# EAGLE board TR4 (EAGLE 9.6.2), part 1 of 2
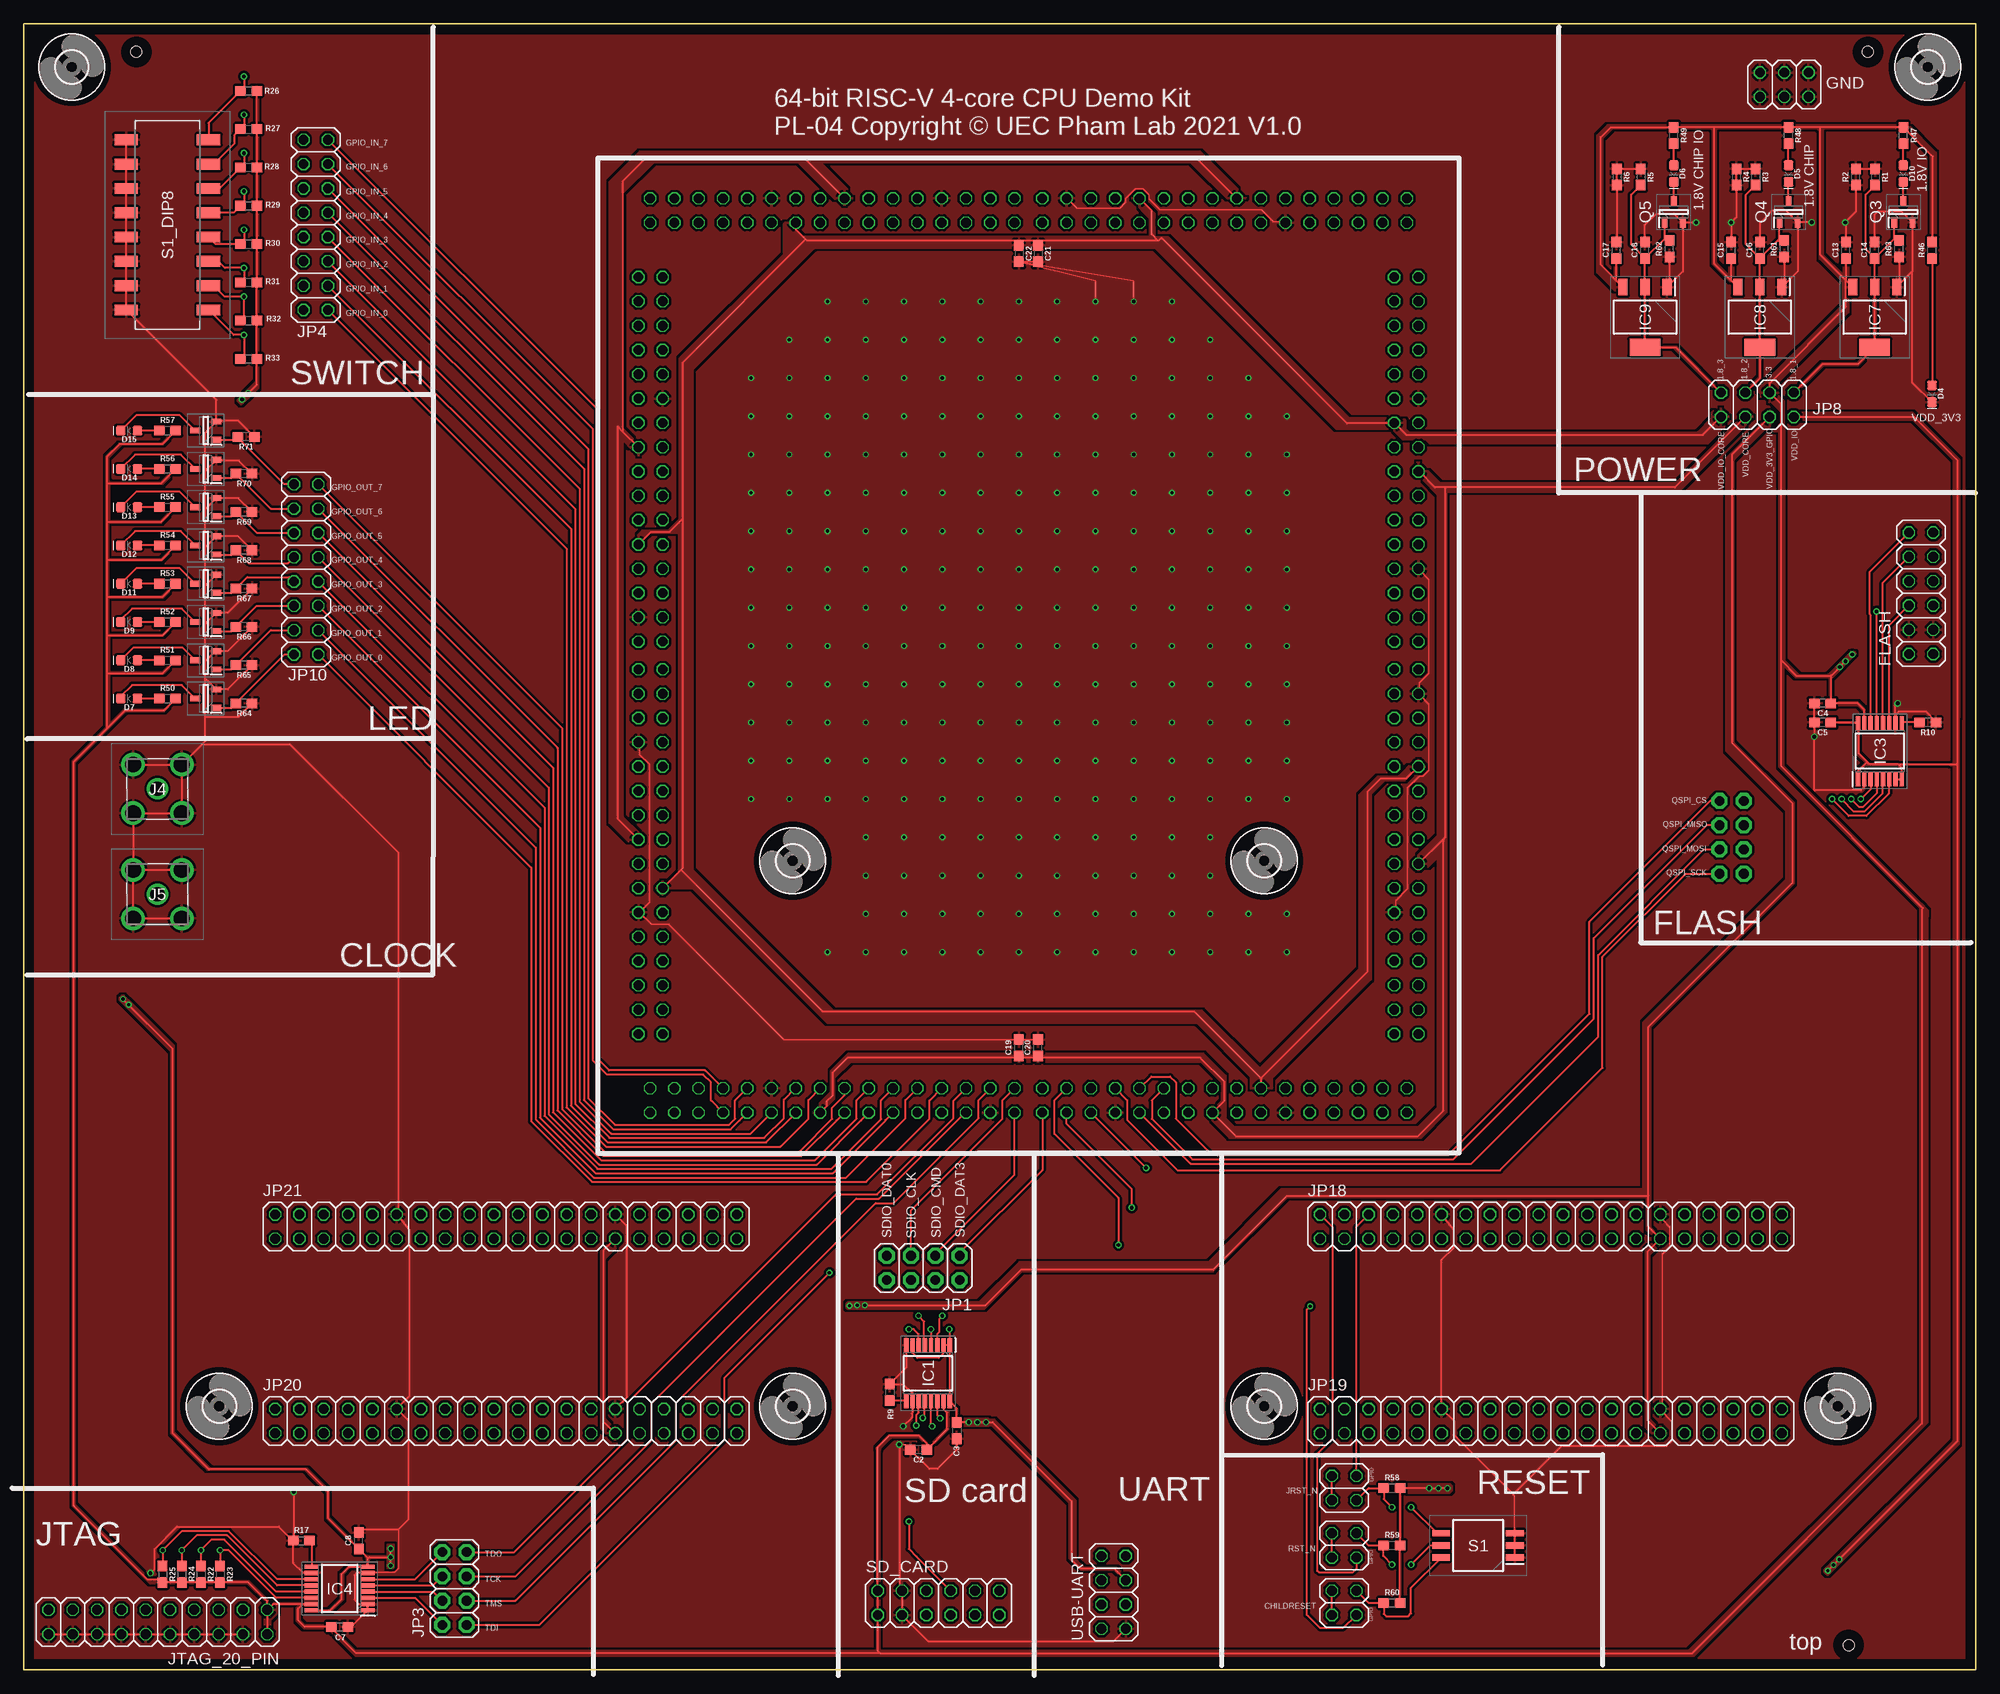
[diagram p5: board, top side]
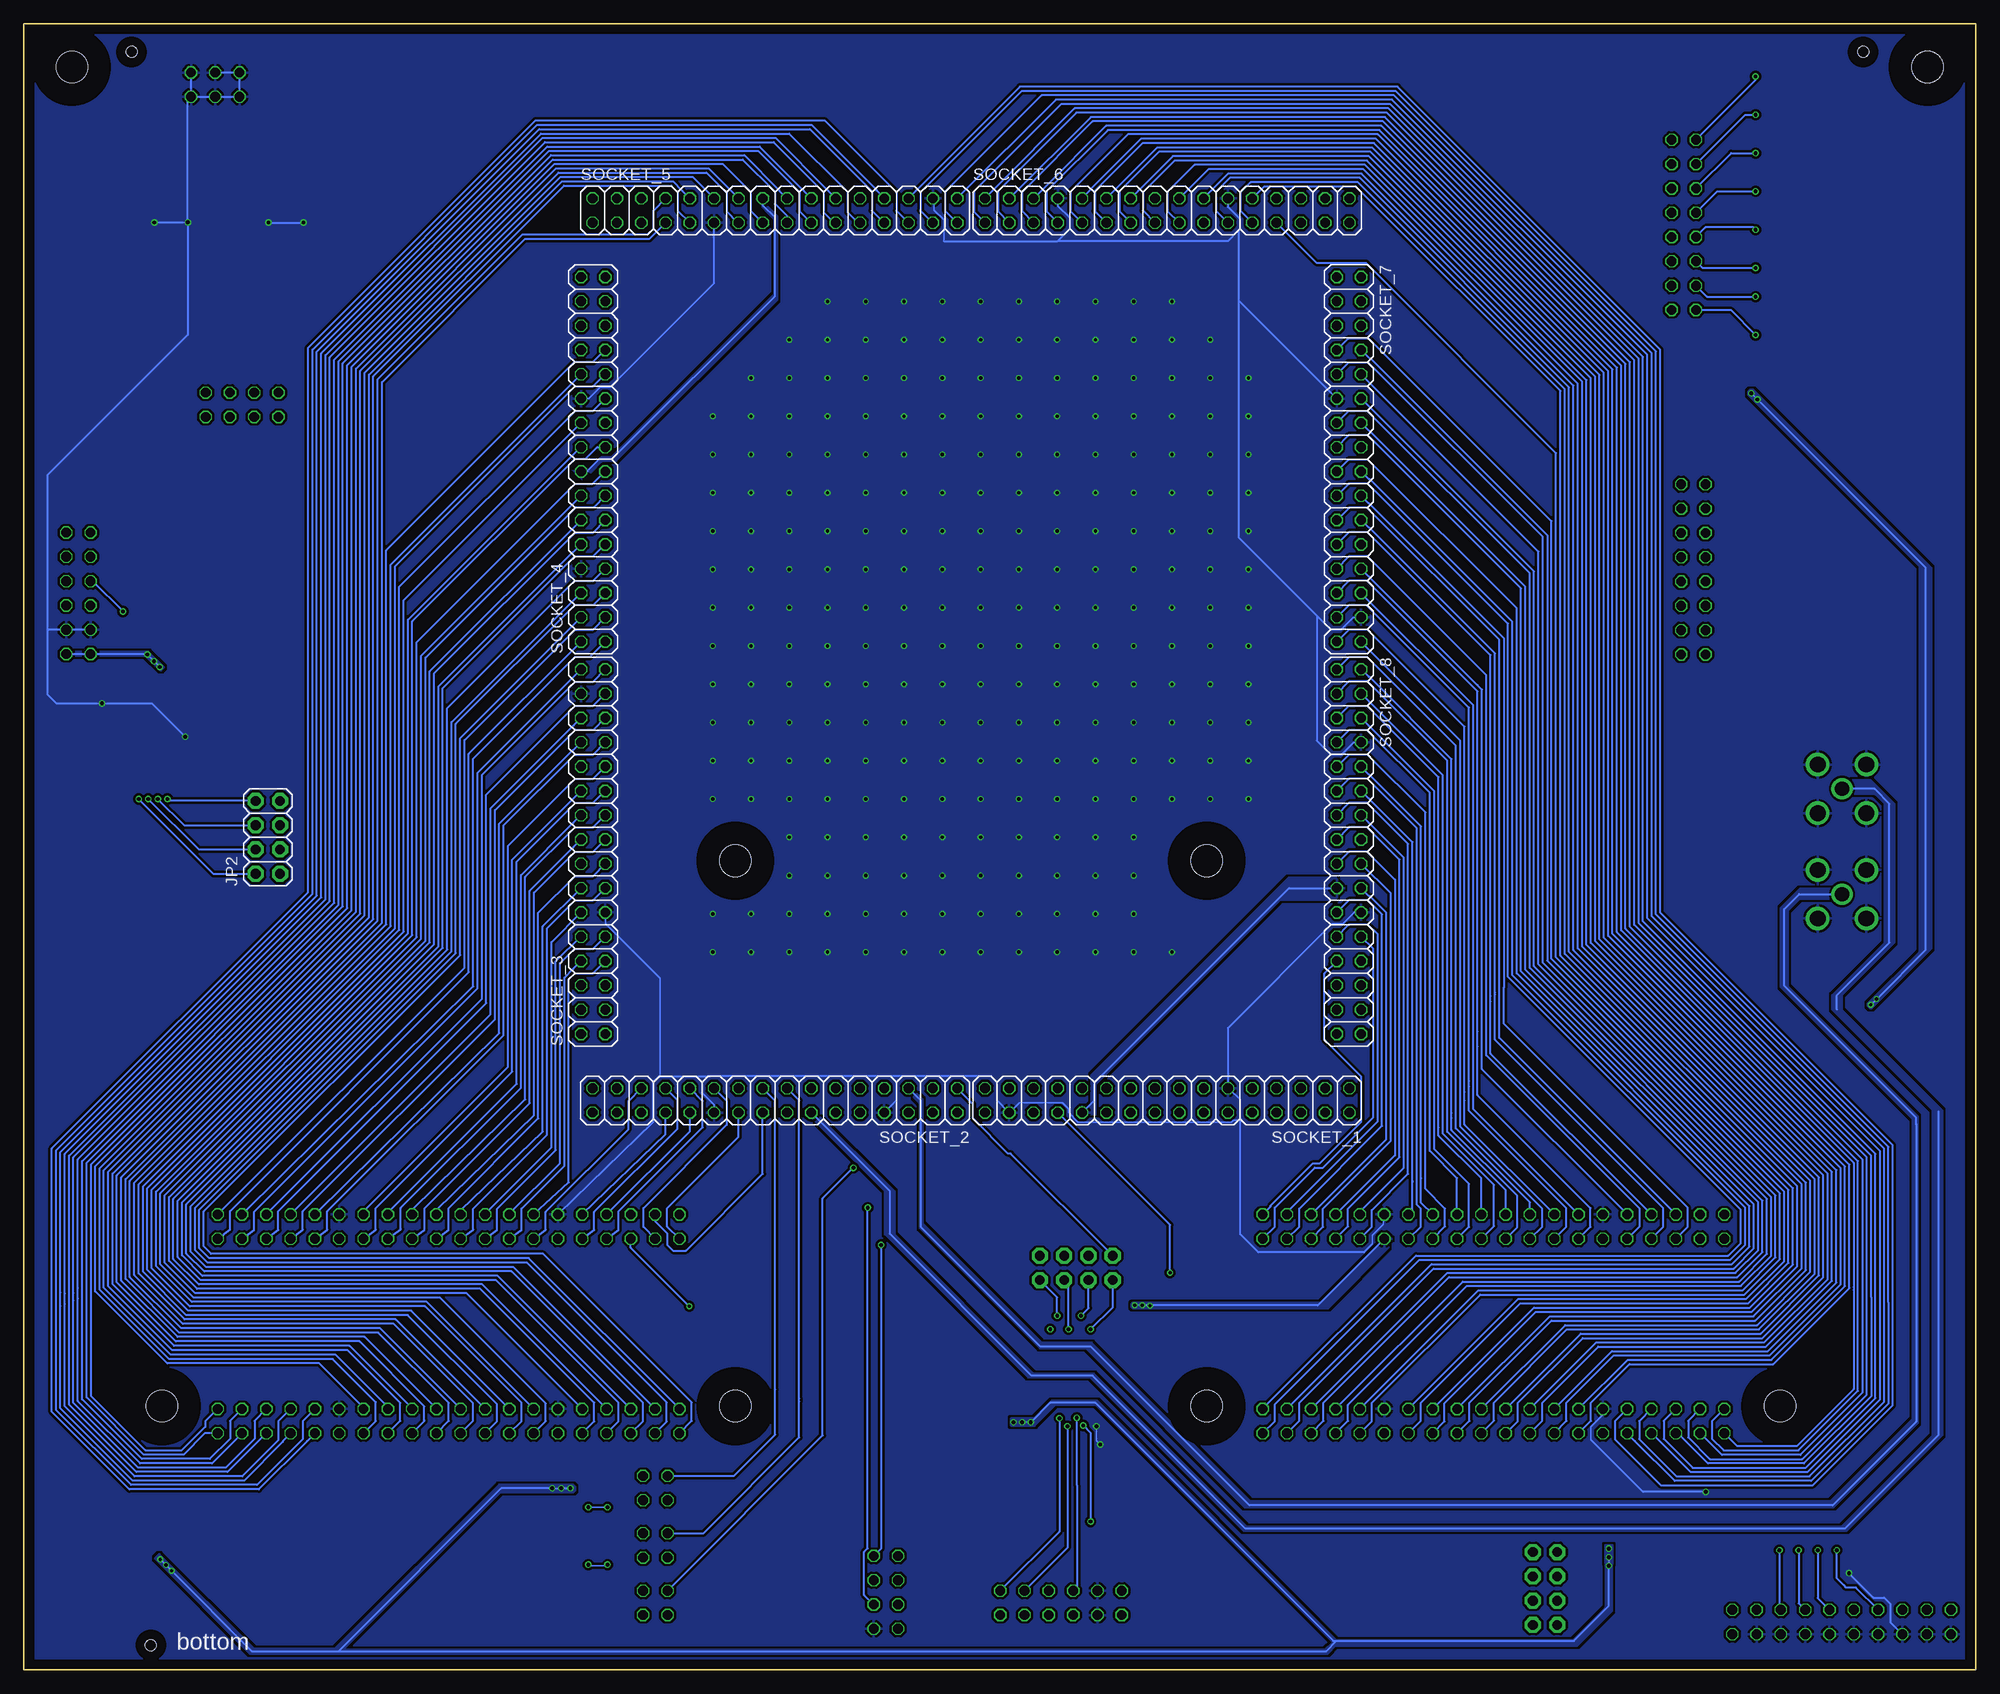
[diagram p6: board, bottom side, seen from below]

Size 204 x 172 mm. Coordinates in mm from the lower left corner, seen from the top.
Outline: 0,172 204,172 204,0 0,0 0,172
Copper layers (1*16): Top 0.035mm / dielectric 1.5mm / Bottom 0.035mm
Design rules "default *": minimum track width 6mil, minimum drill 0.35mm, track to track 10mil, track to pad 10mil, pad to pad 5mil, via to via 10mil, smd to smd 10mil, copper to edge 40mil, drill to drill 6mil, minimum pad ring 0.13mm, minimum via ring 0.13mm, stop-mask expansion 4mil, vias tented up to drill 0mil, thermal gap 10mil
Holes 1.15 mm at 190.74,2.59 192.74,169.09 11.74,169.09

## Footprints (pad centres in the part's own frame; a part is rotated, then mirrored left to right if it is on the bottom)
0603 = smd 1.1 x 1: 1 -0.85,0; 2 0.85,0
LED-0603 = smd 1 x 1: A -0.877,0; C 0.877,0
2X06 = drill 1.016 octagon: 1 -6.35,-1.27; 2 -6.35,1.27; 3 -3.81,-1.27; 4 -3.81,1.27; 5 -1.27,-1.27; 6 -1.27,1.27; 7 1.27,-1.27; 8 1.27,1.27; 9 3.81,-1.27; 10 3.81,1.27; 11 6.35,-1.27; 12 6.35,1.27
2X03 = drill 1.016 octagon: 1 -2.54,-1.27; 2 -2.54,1.27; 3 0,-1.27; 4 0,1.27; 5 2.54,-1.27; 6 2.54,1.27
3,3 = hole 3.3: 0,0
SOP65P640X120-16N = smd 1.475 x 0.45: 1 -2.938,2.275; 2 -2.938,1.625; 3 -2.938,0.975; 4 -2.938,0.325; 5 -2.938,-0.325; 6 -2.938,-0.975; 7 -2.938,-1.625; 8 -2.938,-2.275; 9 2.938,-2.275; 10 2.938,-1.625; 11 2.938,-0.975; 12 2.938,-0.325; 13 2.938,0.325; 14 2.938,0.975; 15 2.938,1.625; 16 2.938,2.275
SOT230P700X180-4N = smd 1.75 x 0.95: 1 -3.15,2.3; 2 -3.15,0; 3 -3.15,-2.3 | smd 1.75 x 3.2: 4 3.15,0
29856004 = drill 1.64 pad 2.46: 1 0,0; 2 5.08,0; 3 5.08,5.08; 4 0,5.08 | drill 1.47 pad 2.205: 5 2.54,2.54
2X04 = drill 1.016 pad 1.676 octagon: 1 -3.81,-1.27; 2 -3.81,1.27; 3 -1.27,-1.27; 4 -1.27,1.27; 5 1.27,-1.27; 6 1.27,1.27; 7 3.81,-1.27; 8 3.81,1.27
2X08 = drill 1.016 octagon: 1 -8.89,-1.27; 2 -8.89,1.27; 3 -6.35,-1.27; 4 -6.35,1.27; 5 -3.81,-1.27; 6 -3.81,1.27; 7 -1.27,-1.27; 8 -1.27,1.27; 9 1.27,-1.27; 10 1.27,1.27; 11 3.81,-1.27; 12 3.81,1.27; 13 6.35,-1.27; 14 6.35,1.27; 15 8.89,-1.27; 16 8.89,1.27
2X02 = drill 1.016 octagon: 1 -1.27,-1.27; 2 -1.27,1.27; 3 1.27,-1.27; 4 1.27,1.27
2X04' = drill 1.016 octagon: 1 -3.81,-1.27; 2 -3.81,1.27; 3 -1.27,-1.27; 4 -1.27,1.27; 5 1.27,-1.27; 6 1.27,1.27; 7 3.81,-1.27; 8 3.81,1.27
2X20 = drill 1.016 octagon: 1 -24.13,-1.27; 2 -24.13,1.27; 3 -21.59,-1.27; 4 -21.59,1.27; 5 -19.05,-1.27; 6 -19.05,1.27; 7 -16.51,-1.27; 8 -16.51,1.27; 9 -13.97,-1.27; 10 -13.97,1.27; 11 -11.43,-1.27; 12 -11.43,1.27; 13 -8.89,-1.27; 14 -8.89,1.27; 15 -6.35,-1.27; 16 -6.35,1.27; 17 -3.81,-1.27; 18 -3.81,1.27; 19 -1.27,-1.27; 20 -1.27,1.27; 21 1.27,-1.27; 22 1.27,1.27; 23 3.81,-1.27; 24 3.81,1.27; 25 6.35,-1.27; 26 6.35,1.27; 27 8.89,-1.27; 28 8.89,1.27; 29 11.43,-1.27; 30 11.43,1.27; 31 13.97,-1.27; 32 13.97,1.27; 33 16.51,-1.27; 34 16.51,1.27; 35 19.05,-1.27; 36 19.05,1.27; 37 21.59,-1.27; 38 21.59,1.27; 39 24.13,-1.27; 40 24.13,1.27
2X10 = drill 1.016 octagon: 1 -11.43,-1.27; 2 -11.43,1.27; 3 -8.89,-1.27; 4 -8.89,1.27; 5 -6.35,-1.27; 6 -6.35,1.27; 7 -3.81,-1.27; 8 -3.81,1.27; 9 -1.27,-1.27; 10 -1.27,1.27; 11 1.27,-1.27; 12 1.27,1.27; 13 3.81,-1.27; 14 3.81,1.27; 15 6.35,-1.27; 16 6.35,1.27; 17 8.89,-1.27; 18 8.89,1.27; 19 11.43,-1.27; 20 11.43,1.27
SOT95P230X110-3N = smd 1.05 x 0.6: 1 -1.1,0.95; 2 -1.1,-0.95; 3 1.1,0
SOT127P835X260-6N = smd 1.85 x 0.65: 1 -3.85,1.27; 2 -3.85,0; 3 -3.85,-1.27; 4 3.85,-1.27; 5 3.85,0; 6 3.85,1.27
2198LPST = smd 1.13 x 2.44: 1 -8.89,-4.3; 2 -6.35,-4.3; 3 -3.81,-4.3; 4 -1.27,-4.3; 5 1.27,-4.3; 6 3.81,-4.3; 7 6.35,-4.3; 8 8.89,-4.3; 9 8.89,4.3; 10 6.35,4.3; 11 3.81,4.3; 12 1.27,4.3; 13 -1.27,4.3; 14 -3.81,4.3; 15 -6.35,4.3; 16 -8.89,4.3
2X16 = drill 1.016 octagon: 1 -19.05,-1.27; 2 -19.05,1.27; 3 -16.51,-1.27; 4 -16.51,1.27; 5 -13.97,-1.27; 6 -13.97,1.27; 7 -11.43,-1.27; 8 -11.43,1.27; 9 -8.89,-1.27; 10 -8.89,1.27; 11 -6.35,-1.27; 12 -6.35,1.27; 13 -3.81,-1.27; 14 -3.81,1.27; 15 -1.27,-1.27; 16 -1.27,1.27; 17 1.27,-1.27; 18 1.27,1.27; 19 3.81,-1.27; 20 3.81,1.27; 21 6.35,-1.27; 22 6.35,1.27; 23 8.89,-1.27; 24 8.89,1.27; 25 11.43,-1.27; 26 11.43,1.27; 27 13.97,-1.27; 28 13.97,1.27; 29 16.51,-1.27; 30 16.51,1.27; 31 19.05,-1.27; 32 19.05,1.27

## Placement (x,y rotation side)
C2  0.1uF  [0603]  93.5,23 180 top
C3  0.1uF  [0603]  97.5,25 270 top
C4  0.1uF  [0603]  188,101 180 top
C5  0.1uF  [0603]  188,99 180 top
C7  0.1uF  [0603]  33,4.5 0 top
C8  0.1uF  [0603]  35,13.5 90 top
C13  10uF  [0603]  190.45,148.35 90 top
C14  100uF  [0603]  193.45,148.35 90 top
C15  10uF  [0603]  178.45,148.35 90 top
C16  100uF  [0603]  181.45,148.35 90 top
C17  10uF  [0603]  166.45,148.35 90 top
C18  100uF  [0603]  169.45,148.35 90 top
C19  0.1uF  [0603]  104,65 90 top
C20  10uF  [0603]  106,65 90 top
C21  0.1uF  [0603]  106,148 270 top
C22  10uF  [0603]  104,148 270 top
D4  [LED-0603]  199.45,133.35 270 top
D5  LED0  [LED-0603]  184.45,156.35 270 top
D6  LED0  [LED-0603]  172.45,156.35 270 top
D7  LED0  [LED-0603]  11,101.5 180 top
D8  LED0  [LED-0603]  11,105.5 180 top
D9  LED0  [LED-0603]  11,109.5 180 top
D10  LED0  [LED-0603]  196.45,156.35 270 top
D11  LED0  [LED-0603]  11,113.5 180 top
D12  LED0  [LED-0603]  11,117.5 180 top
D13  LED0  [LED-0603]  11,121.5 180 top
D14  LED0  [LED-0603]  11,125.5 180 top
D15  LED0  [LED-0603]  11,129.5 180 top
FLASH  PINHD-2X6  [2X06]  198.3,112.5 90 top
GND  PINHD-2X3  [2X03]  184,165.65 0 top
H1  MOUNT-HOLE3.3  [3,3]  20.42,27.55 0 top
H2  MOUNT-HOLE3.3  [3,3]  189.58,27.55 0 top
H3  MOUNT-HOLE3.3  [3,3]  5,167.5 0 top
H4  MOUNT-HOLE3.3  [3,3]  199,167.5 0 top
H5  MOUNT-HOLE3.3  [3,3]  80.36,27.55 0 top
H6  MOUNT-HOLE3.3  [3,3]  129.64,27.55 0 top
H7  MOUNT-HOLE3.3  [3,3]  129.64,84.55 0 top
H8  MOUNT-HOLE3.3  [3,3]  80.36,84.55 0 top
IC1  SN74AVC4T774PWR  [SOP65P640X120-16N]  94.5,31 270 top
IC3  SN74AVC4T774PWR  [SOP65P640X120-16N]  194,96 90 top
IC4  SN74AVC4T774PWR  [SOP65P640X120-16N]  33,8.5 180 top
IC7  LM1117IMPX-ADJ/NOPB  [SOT230P700X180-4N]  193.45,141.35 270 top
IC8  LM1117IMPX-ADJ/NOPB  [SOT230P700X180-4N]  181.45,141.35 270 top
IC9  LM1117IMPX-ADJ/NOPB  [SOT230P700X180-4N]  169.45,141.35 270 top
J4  2985-6004  [29856004]  16.5,94.6 180 top
J5  2985-6004  [29856004]  16.5,83.6 180 top
JP1  [2X04]  94,42 180 top
JP2  [2X04]  178.5,87 90 bottom
JP3  [2X04]  45,8.5 90 top
JP4  [2X08]  30.5,151 90 top
JP5  [2X02]  138,13 90 top
JP6  [2X02]  138,19 90 top
JP8  PINHD-2X4  [2X04']  181.2,132.2 180 top
JP10  [2X08]  29.5,115 90 top
JP18  [2X20]  159.61,46.32 0 top
JP19  [2X20]  159.61,26 0 top
JP20  [2X20]  50.39,26 0 top
JP21  [2X20]  50.39,46.32 0 top
JP24  [2X02]  138,7 90 top
JTAG_20_PIN  [2X10]  14,5 180 top
Q3  BSH103,235  [SOT95P230X110-3N]  196.45,152.35 90 top
Q4  BSH103,235  [SOT95P230X110-3N]  184.45,152.35 90 top
Q5  BSH103,235  [SOT95P230X110-3N]  172.45,152.35 90 top
Q6  BSH103,235  [SOT95P230X110-3N]  19,101.5 180 top
Q7  BSH103,235  [SOT95P230X110-3N]  19,105.5 180 top
Q8  BSH103,235  [SOT95P230X110-3N]  19,109.5 180 top
Q9  BSH103,235  [SOT95P230X110-3N]  19,113.5 180 top
Q10  BSH103,235  [SOT95P230X110-3N]  19,117.5 180 top
Q11  BSH103,235  [SOT95P230X110-3N]  19,121.5 180 top
Q12  BSH103,235  [SOT95P230X110-3N]  19,125.5 180 top
Q13  BSH103,235  [SOT95P230X110-3N]  19,129.5 180 top
R1  15k  [0603]  193.5,156 270 top
R2  6.8k  [0603]  191.5,156 90 top
R3  15k  [0603]  181,156 270 top
R4  6.8k  [0603]  179,156 270 top
R5  15k  [0603]  169,156 270 top
R6  6.8k  [0603]  166.5,156 270 top
R9  10k  [0603]  90.5,29 270 top
R10  10k  [0603]  199,99 180 top
R17  10k  [0603]  29,13.5 0 top
R22  10k  [0603]  18.5,10 270 top
R23  10k  [0603]  20.5,10 270 top
R24  10k  [0603]  16.5,10 270 top
R25  10k  [0603]  14.5,10 270 top
R26  10k  [0603]  23.5,165 0 top
R27  10k  [0603]  23.5,161 0 top
R28  10k  [0603]  23.5,157 0 top
R29  10k  [0603]  23.5,153 0 top
R30  10k  [0603]  23.5,149 0 top
R31  10k  [0603]  23.5,145 0 top
R32  10k  [0603]  23.5,141 0 top
R33  10k  [0603]  23.5,137 0 top
R46  330  [0603]  199.45,148.35 90 top
R47  330  [0603]  196.45,160.35 90 top
R48  330  [0603]  184.45,160.35 90 top
R49  330  [0603]  172.45,160.35 90 top
R50  330  [0603]  15,101.5 0 top
R51  330  [0603]  15,105.5 0 top
R52  330  [0603]  15,109.5 0 top
R53  330  [0603]  15,113.5 0 top
R54  330  [0603]  15,117.5 0 top
R55  330  [0603]  15,121.5 0 top
R56  330  [0603]  15,125.5 0 top
R57  330  [0603]  15,129.5 0 top
R58  10k  [0603]  143,19 0 top
R59  10k  [0603]  143,13 0 top
R60  10k  [0603]  143,7 0 top
R61  10k  [0603]  184,148.5 90 top
R62  10k  [0603]  172,148.5 90 top
R63  10k  [0603]  196,148.5 90 top
R64  10k  [0603]  23,101 180 top
R65  10k  [0603]  23,105 180 top
R66  10k  [0603]  23,109 180 top
R67  10k  [0603]  23,113 180 top
R68  10k  [0603]  23,117 180 top
R69  10k  [0603]  23,121 180 top
R70  10k  [0603]  23,125 180 top
R71  10k  [0603]  23.23,128.85 180 top
S1  DSHP03TSGET  [SOT127P835X260-6N]  152,13 180 top
S1_DIP8  219-8LPST  [2198LPST]  15,151 90 top
SD_CARD  PINHD-2X6  [2X06]  95.6,7 0 top
SOCKET_1  [2X16]  84.5,59.5 180 bottom
SOCKET_2  [2X16]  125.5,59.5 180 bottom
SOCKET_3  [2X16]  144.5,85.5 90 bottom
SOCKET_4  [2X16]  144.5,126.5 90 bottom
SOCKET_5  [2X16]  125.5,152.5 0 bottom
SOCKET_6  [2X16]  84.5,152.5 0 bottom
SOCKET_7  [2X16]  65.5,126.5 270 bottom
SOCKET_8  [2X16]  65.5,85.5 270 bottom
USB-UART  PINHD-2X4  [2X04']  113.9,8.1 90 top

## Tracks (layer width: path | path; a pad name or v marks a point on that pad's centre or on a via)
B1  (via drill 0.4)
  Top 0.2: v95.77,26.29 95.47,26.59 IC1.14
  Bottom 0.2: SD_CARD.12 95.77,14.45 v95.77,26.29
B2  (via drill 0.4)
  Top 0.2: IC1.13 94.83,27.85 94.83,25.56 v94.94,25.45
  Bottom 0.2: SD_CARD.10 94.94,12.74 v94.94,25.45
B3  (via drill 0.4)
  Top 0.2: IC1.12 94.13,28.02 94.13,26.51 v93.95,26.33
  Bottom 0.2: v93.95,26.33 93.95,19.5 93.95,19.31 93.95,8.65 SD_CARD.6
B4  (via drill 0.4)
  Top 0.2: IC1.11 93.53,26.87 93.27,26.61 v93.27,25.54 | SD_CARD.8 93.32,11.82 92.5,12.64 v92.5,15.5
  Bottom 0.2: v93.27,25.54 92.5,24.77 v92.5,15.5
CHILDCLOCK
  Bottom 0.2: SOCKET_2.5 110.25,59.49 110.25,46.27 97.78,33.8 92.5,33.8 75.9,17.2 14.95,17.2 6.2,25.95 6.2,57 6.2,57.06 6.2,57.7 20,71.5 20,79.5 18.44,81.06 J5.5
  pour Bottom: 14.2,81.6 18.4,81.6 20.4,79.6 20.4,71.4 6.6,57.6 6.6,26.2 15.2,17.6 75.8,17.6 92.4,34.2 97.6,34.2 110,46.6 110,59.6 111.2,60.8 112,60.8 110.4,59.2 110.4,46.2 97.8,33.6 93,33.6 76.4,17 14.8,17 6,25.8 6,57.8 19.6,71.4 19.6,79.4 18.4,80.6 14,80.6 13.6,81
CHILDRESET  (via drill 0.4)
  Top 0.2: JP24.2 JP24.4 | v117.3,52.46 SOCKET_2.6
  Bottom 0.2: JP24.4 120.51,24.49 120.51,49.26 v117.31,52.46 v117.3,52.46
CHILDRESET_GPIO  (via drill 0.35)
  Top 0.2: JP24.1 137.89,4.35 135.5,4.35 134.1,5.75 134.1,37.65 v134.45,38
  Bottom 0.2: v134.45,38 140.56,44.11 JP18.5
CLK  (via drill 0.4)
  Top 0.2: IC1.5 94.1,34.01 94.1,36.39 v93.5,36.99 v93.5,37
  Bottom 0.2: v93.5,37 92.7,37.8 92.7,40.7 JP1.6
CMD  (via drill 0.4)
  Top 0.2: IC1.4 94.83,35.58 v94.8,35.6
  Bottom 0.2: v94.8,35.6 94.8,40.26 JP1.4
CS  (via drill 0.4)
  Top 0.2: IC3.3 193.03,92.03 v192,91
  Bottom 0.2: v192,91 184.19,83.19 JP2.2
DAT0  (via drill 0.4)
  Top 0.2: IC1.6 93.53,35.08 93,35.6 v92.5,35.6
  Bottom 0.2: v92.5,35.6 90.19,37.91 JP1.8
DAT3  (via drill 0.4)
  Top 0.2: IC1.3 95.47,35.11 95.68,35.32 95.68,36.68 v96,37
  Bottom 0.2: v96,37 96,38.92 JP1.2
FLASH_CS
  Top 0.2: IC3.14 193.03,110.25 192.96,110.32 192.96,114.78 FLASH.12
FLASH_MISO  (via drill 0.4)
  Top 0.2: IC3.13 193.68,110.57 v193.64,110.6
  Bottom 0.2: v193.64,110.6 196.81,113.77 FLASH.8
FLASH_MOSI
  Top 0.2: IC3.12 194.32,113.61 FLASH.10
FLASH_SCK
  Top 0.2: IC3.11 194.97,109.17 FLASH.6
GND  (via drill 0.35, 0.4)
  Top 0.152: JP18.30 171.24,47.07 172.06,46.26 172.06,44.23 171.24,43.41 171.24,27.36 JP19.30 171.04,27.16 | v91.49,23.55 91.6,23.55 92.1,23.55 92.51,23.14 92.58,23.08 C2.2 | 149.46,24.56 155.68,18.33 155.8,18.22 155.8,14.36 S1.3 | 39.16,14.67 39.16,10.61 38.76,10.2 36.11,10.2 IC4.7 | SOCKET_4.8 145.84,114.94 146.86,113.92 146.86,104.17 145.84,103.16 145.84,102.14 SOCKET_3.30 145.84,101.94 146.86,100.92 146.86,94.01 146.25,93.4 145.84,93.4 144.62,92.18 144.62,81.62 143.41,80.4 143.41,79.18 SOCKET_3.11 | SOCKET_8.8 64.36,96.86 64.36,95.64 65.38,94.62 65.38,80.19 64.36,79.18 64.33,79.17 | 64.33,79.17 SOCKET_8.22 | SOCKET_5.11 131.82,151.31 130.6,151.31 129.33,152.59 118.76,152.59 117.6,153.75 117.6,154.16 116.99,154.77 116.18,154.77 115.16,153.75 115.16,153.35 114.55,152.74 110.08,152.74 109.06,153.75 SOCKET_5.30 | C21.2 C22.2 | C22.2 116,145.15 v116,143 | C20.2 C19.2 79.45,65.85 67.4,77.9 65.59,77.9 64.33,79.17 | C22.2 112,145.15 v112,143
  Top 0.2: C14.2 193.45,152.1 193.78,152.43 196.22,152.43 Q3.2 197.4,146.15 | Q4.2 185.4,146.15 184,144.75 R61.1 | Q4.2 184.19,152.46 182.72,152.46 181.45,151.19 C16.2 | C18.2 169.45,150.99 170.64,152.18 172.47,152.18 Q5.2 | v186.87,151.26 Q4.2 | v174.78,151.24 Q5.2 | S1_DIP8.9 S1_DIP8.10 S1_DIP8.11 S1_DIP8.12 S1_DIP8.13 S1_DIP8.14 S1_DIP8.15 S1_DIP8.16 20.1,132.71 20.1,130.55 | C4.2 C5.2 v187.15,97.52 187.15,91.9 192.03,91.9 192.3,92.18 192.3,92.99 IC3.2 | IC4.10 29.17,10.12 28.15,11.15 28.15,13.45 | 28.15,13.45 R17.1 28.2,13.55 v28.2,18.6 | C7.2 34.21,4.5 IC4.1 IC4.2 35.03,6.88 34.55,7.35 34.55,9.9 34.78,10.12 IC4.7 | R10.1 199.85,99.1 198.8,100.15 196.02,100.15 195.7,99.82 195.7,99.01 IC3.10 195.62,101 v195.85,101 | S1.1 S1.2 S1.3 | J4.2 J4.1 | J4.3 11.5,89.52 | 11.5,89.52 J4.4 J4.1 | 11.5,83.8 11.5,83.68 J5.2 J5.1 | 11.5,83.8 11.5,89.52 | 11.5,83.8 11.42,83.72 J5.3 J5.4 | IC1.8 92.22,31.58 R9.1 91.9,29.85 92.8,28.95 92.8,28.13 IC1.10 92.88,26.86 92.81,26.8 92.81,26.36 v91.9,25.45 | 18.95,103.6 Q6.2 21.3,102.45 R65.1 | 18.95,103.6 18.95,105.4 | 18.95,105.4 18.95,109.3 | 18.95,109.3 Q8.2 21.3,110.45 R67.1 | 18.95,105.4 20.05,106.5 Q7.2 21.3,106.45 R66.1 | 18.95,109.3 18.95,113.3 | 18.95,113.3 Q9.2 | 18.95,113.3 18.95,117.3 | 18.95,117.3 Q10.2 22.4,118.45 R68.1 | 18.95,117.3 18.95,121.3 | 18.95,121.3 Q11.2 22.4,122.45 R69.1 | 18.95,121.3 18.95,125.3 | 18.95,125.3 20.03,126.38 | 20.03,126.38 Q12.2 | 18.95,125.3 18.95,129.3 Q13.2 20.1,130.55 | J4.1 18.95,97.05 18.95,99.55 | 18.95,99.55 18.95,103.6 | JP18.12 149.46,45.99 149.46,44.13 148.18,42.85 JP19.12 149.5,25.95 149.5,24.6 149.46,24.56 | JP21.12 39.13,47.38
  Top 0.2: 39.13,47.38 40.26,45.97 40.26,28.57 JP20.12 40.21,26.02 40.21,15.72 39.16,14.67 35.32,14.67 C8.2 | 155.68,18.33 160.75,23.4 171.7,23.4 172.3,24 172.3,25.9 171.04,27.16 | JP20.30 63.05,28.5 63.05,46.36 JP21.30 | JTAG_20_PIN.20 JTAG_20_PIN.18 JTAG_20_PIN.16 JTAG_20_PIN.14 JTAG_20_PIN.12 JTAG_20_PIN.10 JTAG_20_PIN.8 JTAG_20_PIN.6 JTAG_20_PIN.4 | v13.23,10.11 13.65,10.52 13.65,12.61 16,14.96 26.64,14.96 28.15,13.45 | J4.1 18.65,96.75 27.8,96.75 39.13,85.42 39.13,47.38 | 197.4,146.15 196.12,144.88 196,145 R63.1 | 197.4,146.15 197.4,134.52 D4.C | R64.1 22.4,99.55 18.95,99.55 | R70.1 22.47,126.38 20.03,126.38 | R71.1 22.39,130.55 20.1,130.55 | C3.2 97.5,23 95.5,21 94.65,21 92.58,23.08 | USB-UART.1 113.88,3 94.52,3 SD_CARD.3 SD_CARD.4 91.6,8.46 91.6,23.55 | R2.1 191.5,152.38 v190.37,151.25 190.45,151.17 C13.2 | R2.2 R1.1 | R62.1 172,144.75 IC9.1 173.4,146.15 Q5.2 | R3.1 R4.1 R4.2 179,151.79 v178.45,151.24 C15.2 | R5.1 166.64,156.85 166.5,156.71 R6.2 166.5,149.25 C17.2
  Bottom 0.152: 186.92,97.3 187.12,97.5 v187.15,97.52 | v91.49,23.55 91.9,23.95 91.9,25.38 v91.9,25.45 | 137.51,62.05 137.51,72.27 143.2,77.96 143.2,78.97 SOCKET_3.11 | 107.84,149.31 107.84,151.52 108.86,152.53 108.86,153.75 SOCKET_5.30 | 63.94,43.64 63.04,44.53 63.04,45.42 61.92,46.55 61.92,47.07 JP21.30 | SOCKET_1.11 77.97,60.69 76.86,59.57 76.86,57.6 76.73,57.46 76.75,57.44 76.85,57.44 77.57,57.44 77.77,57.23 93.82,57.23 94.84,58.25 94.84,58.65 95.45,59.26 99.92,59.26 100.94,58.25 SOCKET_1.30 | 40.2,24.03 40.2,25.4 38.96,26.64 JP20.12
  Bottom 0.2: v190.37,151.25 v186.88,151.25 v186.87,151.26 | v178.45,151.24 v174.78,151.24 | v186.87,151.26 186.87,164.21 GND.5 | GND.5 GND.6 | GND.5 GND.3 GND.1 GND.2 GND.4 | v187.15,97.52 190.63,101 v195.85,101 200.61,101 201.54,101.93 201.54,108.6 | v186.87,151.26 186.87,139.51 201.54,124.84 201.54,108.6 | SOCKET_5.11 131.85,144.92 142.66,134.11 143.73,134.11 144.99,132.85 | 95.94,149.31 94.68,150.57 94.68,151.72 95.93,152.97 SOCKET_6.8 | 107.84,149.31 95.94,149.31 | SOCKET_6.22 78.15,152.88 76.89,151.62 76.89,150.59 77.03,150.45 | 95.94,149.31 78.17,149.31 77.03,150.45 | 77.03,150.45 77.03,143.11 | 77.03,143.11 SOCKET_7.11 | 77.03,143.11 77.03,118.34 68.85,110.17 | 68.85,110.17 67.44,108.75 66.28,108.75 65.04,109.99 SOCKET_7.30 | 68.85,110.17 68.85,97.09 67.43,95.67 66.22,95.67 64.96,96.93 SOCKET_8.8 | SOCKET_8.22 64.92,79.15 66.18,77.89 67.31,77.89 78.15,67.05 SOCKET_1.11 | SOCKET_1.30 102.28,59.5 102.28,61.41 102.91,62.04 112.18,62.04 | 112.18,62.04 112.82,61.4 112.82,59.48 SOCKET_2.8 | 112.18,62.04 132.3,62.04 | 132.3,62.04 132.48,62.04 133.14,61.38 133.14,60.32 131.85,59.03 SOCKET_2.22 | JP18.12 138.21,57.24 138.21,61.44 137.6,62.05 137.51,62.05 132.31,62.05 132.3,62.04 | 63.94,43.64 74.99,43.64 76.85,45.5 76.85,57.44 | v13.23,10.11 10.67,7.55 9.55,7.55 8.9,6.9 8.9,4.98 JTAG_20_PIN.16 | v28.2,18.6 34.77,18.6 40.2,24.03 | FLASH.4 FLASH.3 201.45,108.69 201.54,108.6
  other vias: 84,75 88,75 92,75 92,79 88,79 96,75 100,75 104,75 108,75 108,79 104,79 100,79 96,79 112,75 116,75 116,79 112,79 120,75 124,75 128,75 132,75 132,79 128,79 124,79 120,79 88,83 92,83 92,87 88,87 96,83 100,83 104,83 108,83 108,87 104,87 100,87 96,87 112,83 116,83 116,87 112,87 120,83 124,83 124,87 120,87 84,91 88,91 92,91 92,95 88,95 84,95 96,91 100,91 104,91 108,91 108,95 104,95 100,95 96,95 112,91 116,91 116,95 112,95 120,91 124,91 128,91 132,91 132,95 128,95 124,95 120,95 84,99 88,99 92,99 92,103 88,103 84,103 96,99 100,99 104,99 108,99 108,103 104,103 100,103 96,103 112,99 116,99 116,103 112,103 120,99 124,99 128,99 132,99 132,103 128,103 124,103 120,103 84,107 88,107 92,107 92,111 88,111 84,111 96,107 100,107 104,107 108,107 108,111 104,111 100,111 96,111 112,107 116,107 116,111 112,111 120,107 124,107 128,107 132,107 132,111 128,111 124,111 120,111 84,115 88,115 92,115 92,119 88,119 84,119 96,115 100,115 104,115 108,115 108,119 104,119 100,119 96,119 112,115 116,115 116,119 112,119 120,115 124,115 128,115 132,115 132,119 128,119 124,119 120,119 84,123 88,123 92,123 92,127 88,127 84,127 96,123 100,123 104,123 108,123 108,127 104,127 100,127 96,127 112,123 116,123 116,127 112,127 120,123 124,123 128,123 132,123 132,127 128,127 124,127 120,127 84,131 88,131 92,131 92,135 88,135 84,135 96,131 100,131 104,131 108,131 108,135 104,135 100,135 96,135 112,131 116,131 116,135 112,135 120,131 124,131 128,131 132,131 128,135 124,135 120,135 92,143 88,143 84,143 108,143 104,143 100,143 96,143 120,143 92,139 88,139 84,139 108,139 104,139 100,139 96,139 116,139 112,139 124,139 120,139 80,91 80,95 80,99 80,103 80,107 80,111 80,115 80,119 80,123 80,127 80,131 80,135 76,91 76,95 76,99 76,103 76,107 76,111 76,115 76,119 76,123 76,127 76,131 76,135 80,139
  pour Top (rank 2): 0,172 204,172 204,0 0,0
  pour Bottom (rank 2): 0,172 204,172 204,0 0,0
GPIO_IN[0]
  Top 0.2: JP4.1 56.72,117.16 56.72,58.78 60.83,54.67 79.07,54.67 82,57.6 82,59.54 SOCKET_1.15
GPIO_IN[1]
  Top 0.2: JP4.3 57.18,119.24 57.18,58.97 61.02,55.13 77.59,55.13 SOCKET_1.14
GPIO_IN[2]
  Top 0.2: JP4.5 57.63,121.33 57.63,59.16 61.21,55.58 77.38,55.58 79.45,57.65 79.45,59.6 80.62,60.77 SOCKET_1.13
GPIO_IN[3]
  Top 0.2: JP4.7 58.08,123.42 58.08,59.35 61.4,56.03 75.95,56.03 SOCKET_1.12
GPIO_IN[4]
  Top 0.2: JP4.9 58.54,125.5 58.54,59.54 61.59,56.49 73.88,56.49 74.8,57.41 74.8,57.42 SOCKET_1.10
GPIO_IN[5]
  Top 0.2: JP4.11 58.99,127.59 58.99,59.72 61.77,56.94 73.69,56.94 74.35,57.6 74.35,59.51 SOCKET_1.9
GPIO_IN[6]
  Top 0.2: JP4.13 59.45,129.67 59.45,63.71 60.96,62.2 71,62.2 71.8,61.4 71.8,59.5 SOCKET_1.8
GPIO_IN[7]
  Top 0.2: JP4.15 59.9,131.76 59.9,63.9 61.15,62.65 71.19,62.65 SOCKET_1.7
GPIO_OUT[0]
  Top 0.2: JP10.1 53.04,83.84 53.04,57.33 59.38,50.99 88.04,50.99 94.65,57.6 94.65,59.49 SOCKET_1.25
GPIO_OUT[1]
  Top 0.2: JP10.3 53.49,85.93 53.49,57.52 59.57,51.44 85.94,51.44 92.15,57.65 92.15,59.53 SOCKET_1.23
GPIO_OUT[2]
  Top 0.2: JP10.5 53.95,88.01 53.95,57.7 59.76,51.9 84.59,51.9 90.05,57.36 90.05,57.43 SOCKET_1.22
GPIO_OUT[3]
  Top 0.2: JP10.7 54.4,90.1 54.4,57.89 59.94,52.35 84.4,52.35 89.6,57.55 89.6,59.52 SOCKET_1.21
GPIO_OUT[4]
  Top 0.2: JP10.9 54.86,92.18 54.86,58.08 60.13,52.81 82.9,52.81 87.5,57.41 87.5,57.42 SOCKET_1.20
GPIO_OUT[5]
  Top 0.2: JP10.11 55.31,94.27 55.31,58.27 60.32,53.26 82.71,53.26 87.05,57.6 87.05,59.51 SOCKET_1.19
GPIO_OUT[6]
  Top 0.2: JP10.13 55.76,96.36 55.76,58.46 60.51,53.71 81.26,53.71 84.93,57.39 SOCKET_1.18
GPIO_OUT[7]
  Top 0.2: JP10.15 56.27,98.39 56.27,58.6 60.7,54.17 81.07,54.17 84.47,57.58 84.47,58.76 85.77,60.05 SOCKET_1.17
JRST_N
  Top 0.2: JP6.2 JP6.4
  Bottom 0.2: SOCKET_2.17 125.49,59.49 125.49,29.29 125.48,29.28 125.48,24.57 129.78,20.27 JP6.4
JRST_N_GPIO
  Top 0.2: JP6.3 139.3,20.3 139.3,46.33 JP18.6
JTAG_TCK
  Top 0.2: SOCKET_1.28 98.37,58.23 89.37,49.23 86.98,49.23 65.6,27.85 65.6,24 51.37,9.77 JP3.5
JTAG_TDI  (via drill 0.35)
  Top 0.2: JP3.1 53.89,4.69 73.25,24.05 73.25,30.55 v84.2,41.5
  Bottom 0.2: v84.2,41.5 84.2,46.5 SOCKET_1.26
JTAG_TDO
  Top 0.2: SOCKET_1.27 97.15,59.45 97.15,57.65 89.19,49.69 84.89,49.69 63.1,27.9 63.1,24.15 51.26,12.31 JP3.7
JTAG_TMS
  Top 0.2: SOCKET_1.29 99.78,59.54 99.78,57.65 90.91,48.78 89.03,48.78 68.15,27.9 68.15,24 51.38,7.23 JP3.3
LED_0
  Top 0.2: Q6.1 21.7,100.55 R64.2 27.26,106.11 JP10.2
LED_1
  Top 0.2: Q7.1 21.7,104.55 R65.2 25.8,108.65 JP10.4
LED_2
  Top 0.2: Q8.1 21.7,108.55 R66.2 24.34,111.19 JP10.6
LED_3
  Top 0.2: Q9.1 21.7,112.55 R67.2 23.35,114.2 27.76,114.2 JP10.8
LED_4
  Top 0.2: Q10.1 21.7,116.55 R68.2 23.5,115.65 27.61,115.65 JP10.10
LED_5
  Top 0.2: Q11.1 21.7,120.55 R69.2 24.34,118.81 JP10.12
LED_6
  Top 0.2: Q12.1 21.7,124.55 R70.2 25.8,121.35 JP10.14
LED_7
  Top 0.2: Q13.1 22.08,128.55 22.31,128.79 | 22.31,128.79 R71.2 | JP10.16 27.2,123.9 22.31,128.79
MISO  (via drill 0.4)
  Top 0.2: IC3.4 193.68,91.62 192.2,90.15 191.85,90.15 v191,91
  Bottom 0.2: v191,91 185.73,85.73 JP2.4
MOSI  (via drill 0.4)
  Top 0.2: IC3.5 194.25,92.99 194.25,91.56 192.39,89.7 191.29,89.7 190,90.98 v190,91
  Bottom 0.2: v190,91 187.27,88.27 JP2.6
N$9
  Top 0.2: R9.2 92.14,28.15 IC1.9
N$10
  Top 0.2: R10.2 196.34,99 IC3.9
N$12
  Top 0.2: IC4.3 40.89,7.53 JP3.2
N$13
  Top 0.2: IC4.4 42.78,8.17 JP3.4
N$14
  Top 0.2: IC4.5 42.78,8.83 JP3.6
N$15
  Top 0.2: IC4.6 40.89,9.47 JP3.8
N$16
  Top 0.2: R17.2 30.06,13.29 IC4.9
N$17  (via drill 0.4)
  Top 0.2: S1_DIP8.1 21.91,139.5 v23,139.5 23,137.35 R33.1
  Bottom 0.2: JP4.2 25.61,142.11 v23,139.5
N$18  (via drill 0.4)
  Top 0.2: S1_DIP8.2 19.21,144.5 20,144.5 21,143.5 v23,143.5 23,141.35 R32.1
  Bottom 0.2: JP4.4 28.08,143.5 v23,143.5
N$19  (via drill 0.4)
  Top 0.2: R31.1 23,145.35 v23,146.5 21,146.5 20,147.5 19.61,147.5 S1_DIP8.3
  Bottom 0.2: JP4.6 28.54,146.5 v23,146.5
N$20  (via drill 0.4)
  Top 0.2: v23,150.5 23,149.35 R30.1 20.03,149 S1_DIP8.4
  Bottom 0.2: JP4.8 28.23,150.73 23.23,150.73 v23,150.5
N$21  (via drill 0.4)
  Top 0.2: v23,154.5 23,153.35 R29.1 21.92,152.27 S1_DIP8.5
  Bottom 0.2: JP4.10 27,154.5 v23,154.5
N$22  (via drill 0.4)
  Top 0.2: v23,158.5 23,157.35 R28.1 20.46,154.81 S1_DIP8.6
  Bottom 0.2: JP4.12 25.54,158.5 v23,158.5
N$23  (via drill 0.4)
  Top 0.2: v23,162.5 23,161.35 R27.1 22,160.35 22,159.5 19.85,157.35 S1_DIP8.7
  Bottom 0.2: JP4.14 24.08,162.5 v23,162.5
N$24  (via drill 0.4)
  Top 0.2: v23,166.5 23,165.35 R26.1 19.3,161.65 S1_DIP8.8
  Bottom 0.2: JP4.16 23,166.12 v23,166.5
N$26  (via drill 0.4)
  Top 0.2: JP5.3 140.54,13 142.1,13 | 142.1,13 R59.1 | v145,11 147,13 S1.5 | 142.1,13 142.1,11.9 v143,11
  Bottom 0.152: v145,11 144.83,10.9 143.2,10.9 v143,11
N$28
  Top 0.2: JP24.3 140.54,7 R60.1 142.15,5.85 142.4,5.6 144.7,5.6 145,5.9 145,8.58 S1.6
N$38
  Top 0.2: R46.1 D4.A
N$39
  Top 0.2: D10.A R47.1
N$40
  Top 0.2: Q3.3 D10.C
N$44  (via drill 0.4)
  Top 0.2: JP6.1 140.54,19 R58.1 142.15,17.85 v143,17 | v145,17 147.73,14.27 S1.4
  Bottom 0.152: v145,17 144.83,17 143.2,17 v143,17
N$45
  Top 0.2: D5.A R48.1
N$46
  Top 0.2: Q4.3 D5.C
N$47
  Top 0.2: D6.A R49.1
N$48
  Top 0.2: Q5.3 D6.C
N$249
  Top 0.2: R50.1 D7.A
N$250
  Top 0.2: Q6.3 16.5,102.9 11.3,102.9 10.12,101.72 D7.C
N$251
  Top 0.2: R51.1 D8.A
N$252
  Top 0.2: Q7.3 16.6,106.8 11.42,106.8 D8.C
N$253
  Top 0.2: R52.1 D9.A
N$254
  Top 0.2: Q8.3 16.5,110.9 11.3,110.9 10.12,109.72 D9.C
N$255
  Top 0.2: R53.1 D11.A
N$256
  Top 0.2: Q9.3 16.3,115.1 11.72,115.1 D11.C
N$257
  Top 0.2: R54.1 D12.A
N$258
  Top 0.2: Q10.3 16.4,119 11.62,119 D12.C
N$259
  Top 0.2: R55.1 D13.A
N$260
  Top 0.2: Q11.3 16.3,123.1 11.72,123.1 D13.C
N$261
  Top 0.2: R56.1 D14.A
N$262
  Top 0.2: Q12.3 16.4,127 11.62,127 D14.C
N$263
  Top 0.2: R57.1 D15.A
N$264
  Top 0.2: Q13.3 16.3,131.1 11.72,131.1 D15.C
QSPI_CS
  Top 0.2: SOCKET_2.7 115.3,59.54 115.3,57.5 120.6,52.2 154.3,52.2 165,62.9 165,74.5 173.69,83.19 JP2.1
QSPI_MISO
  Top 0.2: SOCKET_2.10 121.94,52.9 151.3,52.9 164.55,66.15 164.55,74.69 175.59,85.73 JP2.3
QSPI_MOSI
  Top 0.2: SOCKET_2.11 117.9,59.52 117.9,57.58 122.13,53.35 149.4,53.35 164.09,68.05 164.09,76.48 175.89,88.27 JP2.5
QSPI_SCK
  Top 0.2: SOCKET_2.9 117.84,62 119.8,62 120.4,61.4 120.4,57.6 124.19,53.81 148.91,53.81 163.64,68.54 163.64,78.16 176.28,90.81 JP2.7
RST_N
  Top 0.2: JP5.2 JP5.4
  Bottom 0.2: SOCKET_2.15 122.96,59.5 122.96,28.35 122.96,28.04 122.96,24.29 132.98,14.27 JP5.4
RST_N_GPIO
  Top 0.2: JP5.1 139.27,10.57 138.85,10.15 135.4,10.15 135.2,10.35 135.2,22.6 136.8,24.2 136.8,46.27 JP18.2
SCK  (via drill 0.4)
  Top 0.2: IC3.6 194.9,92.99 194.9,91.57 192.58,89.24 190.74,89.24 189,90.98 v189,91
  Bottom 0.2: JP2.8 188.81,90.81 v189,91
SDIO_CLK
  Top 0.2: SOCKET_1.31 102.28,59.5 102.28,57.59 92.73,48.04 JP1.5
SDIO_CMD
  Top 0.2: SOCKET_1.32 103.53,58.21 103.53,51.73 95.27,43.47 JP1.3
SDIO_DAT_0
  Bottom 0.2: JP1.7 100.87,53.95 101.12,53.95 104.82,57.65 104.82,59.13 SOCKET_2.1
SDIO_DAT_3
  Top 0.2: SOCKET_2.2 106.45,52.23 97.81,43.59 JP1.1
SYS_CLK
  Bottom 0.2: SOCKET_2.14 113.48,50.02 113.48,45.56 98.67,30.75 92.3,30.75 76.3,14.75 13.65,14.75 3.85,24.55 3.85,58.35 | 14.5,69 14.5,70.5 9,76 9,90.5 10.56,92.06 J4.5
  pour Bottom: 14.5,93 11,93 8.5,90.5 8.5,76 14,70.5 14,69 3.5,58.5 3.5,24.5 13.5,14.5 76.5,14.5 92.5,30.5 99,30.5 114,45.5 114,50 122,58 121.5,58.5 113,50 113,45.5 98.5,31 92.2,31 76.2,15 14,15 4.5,24.5 4.5,58.5 15,69 15,70.5 9.5,76 9.5,90.5 10.5,91.5 14.5,91.5
TCK  (via drill 0.4)
  Top 0.2: IC4.12 26.47,8.83 21.24,14.05 18.05,14.05 v16.5,12.5 R24.1
  Bottom 0.2: v16.5,12.5 16.5,7.5 JTAG_20_PIN.9
TDI  (via drill 0.4)
  Top 0.2: IC4.14 26.38,7.53 21.4,12.5 v20.5,12.5 R23.1
  Bottom 0.2: v20.5,12.5 20.5,6.42 JTAG_20_PIN.5
TDO  (via drill 0.4)
  Top 0.2: IC4.11 26.46,9.47 21.43,14.51 16.51,14.51 v14.5,12.5 R25.1
  Bottom 0.2: JTAG_20_PIN.13 12.52,8.6 13.55,8.6 13.83,8.88 14.5,9.55 v14.5,12.5
TLPORT_A_BITS_ADDRESS[0]
  Bottom 0.2: JP19.18 165.15,36.62 187.2,36.62 192.01,41.43 192.01,50.72 165.21,77.52 165.21,115.31 146.38,134.14 144.48,134.14 SOCKET_4.23
TLPORT_A_BITS_ADDRESS[1]
  Bottom 0.2: JP19.17 154.55,25.98 154.55,27.75 163.87,37.07 187.01,37.07 191.56,41.62 191.56,50.53 164.76,77.33 164.76,113.19 146.35,131.6 144.48,131.6 SOCKET_4.21
TLPORT_A_BITS_ADDRESS[2]
  Bottom 0.2: JP19.16 163.52,37.53 186.82,37.53 191.1,41.81 191.1,50.34 164.3,77.14 164.3,111.78 SOCKET_4.20
TLPORT_A_BITS_ADDRESS[3]
  Bottom 0.2: JP19.15 152,25.99 152,27.91 162.09,37.99 186.65,37.99 190.65,41.99 190.65,50.16 163.85,76.96 163.85,109.74 145.82,127.77 SOCKET_4.18
TLPORT_A_BITS_ADDRESS[4]
  Bottom 0.2: JP19.14 161.9,38.45 186.46,38.45 190.19,42.18 190.19,49.97 163.39,76.77 163.39,109.56 146.4,126.55 145.3,126.55 144.08,127.77 SOCKET_4.17
TLPORT_A_BITS_ADDRESS[5]
  Bottom 0.2: JP19.13 149.45,26 149.45,27.85 160.5,38.9 186.27,38.9 189.74,42.37 189.74,49.78 162.94,76.58 162.94,107.41 146.4,123.95 144.55,123.95 143.27,125.23 SOCKET_4.15
TLPORT_A_BITS_ADDRESS[6]
  Bottom 0.2: JP19.10 157.73,39.36 186.09,39.36 189.29,42.56 189.29,49.59 162.49,76.39 162.49,105.96 145.77,122.67 SOCKET_4.14
TLPORT_A_BITS_ADDRESS[7]
  Bottom 0.2: JP19.9 144.4,25.97 144.4,27.93 156.29,39.82 185.9,39.82 188.83,42.75 188.83,49.4 162.03,76.2 162.03,105.77 146.3,121.5 144.42,121.5 SOCKET_4.13
TLPORT_A_BITS_ADDRESS[8]
  Bottom 0.2: JP19.8 156.1,40.27 185.72,40.27 188.38,42.93 188.38,49.22 161.58,76.02 161.58,104.34 SOCKET_4.12
TLPORT_A_BITS_ADDRESS[9]
  Bottom 0.2: JP19.7 141.85,25.98 141.85,27.92 154.66,40.73 185.53,40.73 187.92,43.12 187.92,49.03 161.12,75.83 161.12,104.13 146.4,118.85 144.53,118.85 SOCKET_4.11
TLPORT_A_BITS_ADDRESS[10]
  Bottom 0.2: JP19.6 154.47,41.18 185.34,41.18 187.47,43.31 187.47,48.84 160.67,75.64 160.67,102.77 146.64,116.8 146.58,116.8 SOCKET_4.10
TLPORT_A_BITS_ADDRESS[11]
  Bottom 0.2: JP19.5 139.3,25.99 139.3,27.91 153.03,41.63 185.15,41.63 187.02,43.5 187.02,48.65 160.22,75.45 160.22,102.58 146.45,116.35 144.49,116.35 SOCKET_4.9
TLPORT_A_BITS_ADDRESS[12]
  Bottom 0.2: JP19.4 152.84,42.09 184.96,42.09 186.56,43.69 186.56,48.46 159.76,75.26 159.76,100.49 146.45,113.8 144.5,113.8 SOCKET_4.7
TLPORT_A_BITS_ADDRESS[13]
  Bottom 0.2: JP19.3 136.8,25.95 136.8,27.95 151.41,42.56 184.8,42.56 186.11,43.87 186.11,48.28 159.31,75.08 159.31,99.03 145.81,112.53 SOCKET_4.6
TLPORT_A_BITS_ADDRESS[14]
  Bottom 0.2: JP19.2 151.24,43.03 184.62,43.03 185.65,44.06 185.65,48.09 158.85,74.89 158.85,98.85 146.4,111.3 144.46,111.3 SOCKET_4.5
TLPORT_A_BITS_ADDRESS[15]
  Bottom 0.2: JP19.1 134.2,26.01 134.2,27.95 149.73,43.48 184.43,43.48 185.2,44.25 185.2,47.9 158.4,74.7 158.4,97.36 SOCKET_4.4
TLPORT_A_BITS_ADDRESS[16]
  Bottom 0.2: SOCKET_4.3 144.52,108.7 146.4,108.7 157.95,97.15 157.95,73.84 157.95,73.38 JP18.40
TLPORT_A_BITS_ADDRESS[17]
  Bottom 0.2: JP18.39 182.45,46.02 182.45,47.95 157.49,72.91 157.49,95.73 SOCKET_4.2
TLPORT_A_BITS_ADDRESS[18]
  Bottom 0.2: JP18.38 157.04,71.43 157.04,95.21 146.4,105.85 144.83,105.85 SOCKET_4.1
TLPORT_A_BITS_ADDRESS[19]
  Bottom 0.2: JP18.37 179.95,45.98 179.95,47.85 156.58,71.22 156.58,93.74 SOCKET_3.32
TLPORT_A_BITS_ADDRESS[20]
  Bottom 0.2: SOCKET_3.31 144.53,103.25 146.4,103.25 156.13,93.52 156.13,70.93 156.13,70.12 JP18.36
TLPORT_A_BITS_ADDRESS[21]
  Bottom 0.2: JP18.35 177.4,45.99 177.4,47.95 155.68,69.67 155.68,91.47 146.4,100.75 144.49,100.75 SOCKET_3.29
TLPORT_A_BITS_ADDRESS[22]
  Bottom 0.2: SOCKET_3.28 146.54,98.7 155.22,90.02 155.22,69.13 155.22,68.49 JP18.34
TLPORT_A_BITS_ADDRESS[23]
  Bottom 0.2: JP18.33 174.85,46 174.85,47.9 154.77,67.98 154.77,89.83 146.35,98.25 144.45,98.25 SOCKET_3.27
TLPORT_A_BITS_ADDRESS[24]
  Bottom 0.2: JP18.32 154.31,66.54 154.31,88.43 146.64,96.1 146.6,96.1 SOCKET_3.26
TLPORT_A_BITS_ADDRESS[25]
  Bottom 0.2: JP18.31 172.3,46.01 172.3,47.9 153.86,66.34 153.86,88.24 146.45,95.65 144.51,95.65 SOCKET_3.25
TLPORT_A_BITS_ADDRESS[26]
  Bottom 0.2: SOCKET_3.23 144.52,93.1 146.4,93.1 153.41,86.09 153.41,63.01 168.5,47.91 JP18.28
TLPORT_A_BITS_ADDRESS[27]
  Bottom 0.2: JP18.27 167.23,46 167.23,48.24 152.95,62.52 152.95,84.67 SOCKET_3.22
TLPORT_A_BITS_ADDRESS[28]
  Bottom 0.2: SOCKET_3.21 144.48,90.6 146.35,90.6 152.5,84.45 152.5,61.24 165.98,47.76 165.98,47.61 JP18.26
TLPORT_A_BITS_ADDRESS[29]
  Bottom 0.2: JP18.25 164.62,46.05 164.62,48.28 152.04,60.86 152.04,83.05 146.59,88.5 146.58,88.5 SOCKET_3.20
TLPORT_A_BITS_ADDRESS[30]
  Bottom 0.2: JP18.24 163.42,48.09 151.59,59.6 151.59,82.86 146.4,88.05 144.49,88.05 SOCKET_3.19
TLPORT_A_BITS_ADDRESS[31]
  Bottom 0.2: JP18.23 162.13,46.02 162.13,48.23 151.14,59.22 151.14,81.41 146.59,85.95 SOCKET_3.18
TLPORT_A_BITS_CORRUPT
  Bottom 0.2: JP20.19 47.85,26 47.85,27.9 41.07,34.67 22.28,34.67 15.92,41.03 15.92,51.66 40.22,75.96 40.22,134.96 63.43,158.18 83.91,158.18 87.5,154.59 87.5,154.58 SOCKET_6.14
TLPORT_A_BITS_DATA[0]
  Bottom 0.2: JP20.18 39.63,34.22 22.09,34.22 15.47,40.84 15.47,51.85 39.76,76.15 39.76,135.15 63.25,158.63 85.37,158.63 89.5,154.5 89.5,152.42 SOCKET_6.13
TLPORT_A_BITS_DATA[1]
  Bottom 0.2: JP20.17 45.3,26.01 45.3,27.91 39.44,33.77 21.9,33.77 15.01,40.66 15.01,52.04 39.31,76.34 39.31,135.34 63.06,159.09 85.56,159.09 89.95,154.69 89.95,154.67 SOCKET_6.12
TLPORT_A_BITS_DATA[2]
  Bottom 0.2: JP20.16 38,33.31 21.71,33.31 14.56,40.47 14.56,52.23 38.86,76.52 38.86,135.53 62.87,159.54 87.06,159.54 92.05,154.55 92.05,152.43 SOCKET_6.11
TLPORT_A_BITS_DATA[3]
  Bottom 0.2: JP20.15 42.75,26.02 42.75,27.92 37.81,32.86 21.53,32.86 14.1,40.28 14.1,52.41 38.4,76.71 38.4,135.72 62.68,159.99 87.25,159.99 92.5,154.74 92.5,154.66 SOCKET_6.10
TLPORT_A_BITS_DATA[4]
  Bottom 0.2: JP20.14 36.36,32.4 21.34,32.4 13.65,40.09 13.65,52.6 37.95,76.9 37.95,135.9 62.49,160.45 88.6,160.45 94.6,154.45 94.6,152.44 SOCKET_6.9
TLPORT_A_BITS_DATA[5]
  Bottom 0.2: JP20.13 40.2,26.03 40.2,27.93 36.18,31.95 21.15,31.95 13.2,39.9 13.2,52.79 37.49,77.09 37.49,136.09 62.3,160.9 90.7,160.9 97.1,154.5 97.1,152.4 SOCKET_6.7
TLPORT_A_BITS_DATA[6]
  Bottom 0.2: SOCKET_6.6 97.55,154.69 90.89,161.36 62.12,161.36 37.04,136.28 37.04,77.28 12.74,52.98 12.74,40 12.74,39.72 12.74,29.34 18.69,23.39 24.92,23.39 JP20.1
TLPORT_A_BITS_DATA[7]
  Bottom 0.2: SOCKET_6.5 99.7,152.46 99.7,154.4 92.29,161.81 61.93,161.81 36.59,136.47 36.59,77.46 12.29,53.17 12.29,29.15 18.51,22.93 26.33,22.93 27.55,24.15 27.55,25.98 JP20.2
TLPORT_A_BITS_DATA[8]
  Bottom 0.2: SOCKET_6.4 100.97,153.77 92.48,162.26 61.74,162.26 36.13,136.66 36.13,77.65 11.83,53.35 11.83,28.96 18.32,22.48 26.52,22.48 28.77,24.73 JP20.3
TLPORT_A_BITS_DATA[9]
  Bottom 0.2: SOCKET_6.3 102.2,152.42 102.2,154.5 93.98,162.72 61.55,162.72 35.68,136.84 35.68,77.84 11.38,53.54 11.38,39.5 11.38,39.15 11.38,28.77 18.13,22.02 27.77,22.02 30.05,24.3 30.05,26.02 JP20.4
TLPORT_A_BITS_DATA[10]
  Bottom 0.2: SOCKET_6.2 102.65,154.67 102.65,154.69 94.17,163.17 61.37,163.17 35.22,137.03 35.22,78.03 10.93,53.73 10.93,39.4 10.93,38.96 10.93,28.59 17.94,21.57 27.96,21.57 31.12,24.73 JP20.5
TLPORT_A_BITS_DATA[11]
  Bottom 0.2: SOCKET_6.1 104.7,152.38 104.7,154.5 95.57,163.63 61.18,163.63 34.77,137.22 34.77,78.22 10.47,53.92 10.47,28.4 17.75,21.12 29.57,21.12 32.6,24.15 32.6,26.01 JP20.6
TLPORT_A_BITS_DATA[12]
  Bottom 0.2: SOCKET_5.32 96.14,164.08 60.99,164.08 34.32,137.41 34.32,78.57 10.02,54.27 10.02,28.21 17.57,20.66 29.75,20.66 33.82,24.73 JP20.7
TLPORT_A_BITS_DATA[13]
  Bottom 0.2: SOCKET_5.31 107.7,152.48 107.7,154.45 97.62,164.53 60.8,164.53 33.86,137.59 33.86,78.75 9.56,54.46 9.56,38.9 9.56,38.4 9.56,28.02 17.38,20.21 31.26,20.21 35.15,24.1 35.15,26 JP20.8
TLPORT_A_BITS_DATA[14]
  Bottom 0.2: SOCKET_5.29 109.03,151.23 110.3,152.5 110.3,154.4 99.71,164.99 60.61,164.99 33.41,137.78 33.41,78.94 9.11,54.64 9.11,38.4 9.11,38.21 9.11,27.83 17.19,19.75 31.45,19.75 35.6,23.91 35.6,23.92 JP20.9
TLPORT_A_BITS_DATA[15]
  Bottom 0.2: SOCKET_5.28 110.75,154.55 110.75,154.59 99.9,165.44 60.42,165.44 32.95,137.97 32.95,79.13 8.66,54.83 8.66,27.65 17,19.3 32.9,19.3 37.7,24.1 37.7,25.99 JP20.10
TLPORT_A_BITS_DATA[16]
  Bottom 0.2: SOCKET_5.27 112.8,152.5 112.8,154.4 120.31,161.91 150.52,161.91 174.29,138.14 174.29,81.28 201.09,54.48 201.09,26.96 192.99,18.86 179.44,18.86 174.4,23.91 174.4,23.92 JP19.31
TLPORT_A_BITS_DATA[17]
  Bottom 0.2: JP19.32 174.85,26 174.85,24.1 179.63,19.32 192.8,19.32 200.64,27.15 200.64,54.29 173.84,81.09 173.84,137.95 150.33,161.46 121.66,161.46 114.9,154.69 114.9,154.6 SOCKET_5.26
TLPORT_A_BITS_DATA[18]
  Bottom 0.2: SOCKET_5.25 115.35,152.5 115.35,154.5 121.85,161 150.15,161 173.38,137.76 173.38,80.91 200.18,54.11 200.18,39.45 200.18,38.04 200.18,27.34 192.62,19.77 180.99,19.77 176.95,23.81 176.95,23.91 JP19.33
TLPORT_A_BITS_DATA[19]
  Bottom 0.2: SOCKET_5.23 116.83,151.23 117.9,152.3 117.9,154.45 124,160.55 149.96,160.55 172.93,137.58 172.93,80.72 199.73,53.92 199.73,39.35 199.73,38.23 199.73,27.53 192.43,20.23 181.17,20.23 177.4,24 177.4,25.99 JP19.34
TLPORT_A_BITS_DATA[20]
  Bottom 0.2: SOCKET_5.22 119.95,154.57 119.95,154.59 125.45,160.09 149.77,160.09 172.47,137.39 172.47,80.53 199.27,53.73 199.27,39.25 199.27,38.42 199.27,27.71 192.24,20.68 182.71,20.68 JP19.35
TLPORT_A_BITS_DATA[21]
  Bottom 0.2: SOCKET_5.21 119.33,151.23 120.4,152.3 120.4,154.4 125.64,159.64 149.53,159.64 172.02,137.15 172.02,80.34 198.82,53.54 198.82,39.4 198.82,38.61 198.82,27.9 192.05,21.13 182.92,21.13 179.9,24.15 179.9,26.03 JP19.36
TLPORT_A_BITS_DATA[22]
  Bottom 0.2: SOCKET_5.20 122.5,154.58 122.5,154.59 127.09,159.19 149.29,159.19 171.57,136.91 171.57,80.15 198.37,53.35 198.37,39.9 198.37,38.8 198.37,28.09 191.86,21.59 184.34,21.59 JP19.37
TLPORT_A_BITS_DATA[23]
  Bottom 0.2: SOCKET_5.19 121.73,151.23 122.95,152.45 122.95,154.4 127.28,158.73 149.1,158.73 171.11,136.72 171.11,79.97 197.91,53.17 197.91,41.15 197.91,38.98 197.91,28.28 191.68,22.04 184.56,22.04 182.45,24.15 182.45,26.02 JP19.38
TLPORT_A_BITS_DATA[24]
  Bottom 0.2: SOCKET_5.18 125.05,154.59 125.05,154.64 128.69,158.28 148.92,158.28 170.66,136.54 170.66,79.78 197.46,52.98 197.46,41.5 197.46,39.17 197.46,28.47 191.49,22.5 187.31,22.5 185.08,24.73 JP19.39
TLPORT_A_BITS_DATA[25]
  Bottom 0.2: SOCKET_5.17 124.23,151.93 125.5,153.2 125.5,154.45 128.87,157.82 148.73,157.82 170.2,136.35 170.2,79.59 197,52.79 197,28.65 191.3,22.95 187.5,22.95 185.05,25.4 185.05,25.96 JP19.40
TLPORT_A_BITS_DATA[26]
  Bottom 0.2: SOCKET_5.15 128.04,152.5 128.04,154.45 130.96,157.37 148.54,157.37 169.75,136.16 169.75,79.4 196.55,52.6 196.55,39.55 189.02,32.02 173.12,32.02 168.5,27.4 JP19.28
TLPORT_A_BITS_DATA[27]
  Bottom 0.2: SOCKET_5.14 132.46,156.92 148.35,156.92 169.3,135.97 169.3,79.21 196.1,52.41 196.1,39.74 188.83,32.47 171.73,32.47 167.23,27.97 167.23,26 JP19.27
TLPORT_A_BITS_DATA[28]
  Bottom 0.2: SOCKET_5.13 129.38,151.23 130.55,152.4 130.55,154.35 132.66,156.46 148.11,156.46 168.84,135.73 168.84,79.03 195.64,52.23 195.64,39.92 188.67,32.95 171.42,32.95 165.96,27.49 JP19.26
TLPORT_A_BITS_DATA[29]
  Bottom 0.2: JP19.25 164.67,26.02 164.67,27.9 170.19,33.41 188.49,33.41 195.19,40.11 195.19,52.04 168.39,78.84 168.39,135.55 147.93,156.01 134.09,156.01 SOCKET_5.12
TLPORT_A_BITS_DATA[30]
  Bottom 0.2: SOCKET_5.10 135.2,154.58 135.2,154.59 136.16,155.55 147.74,155.55 167.93,135.36 167.93,78.65 194.73,51.85 194.73,40.3 188.3,33.87 169.97,33.87 163.42,27.32 JP19.24
TLPORT_A_BITS_DATA[31]
  Bottom 0.2: SOCKET_5.9 135.65,152.49 135.65,154.4 136.35,155.1 147.55,155.1 167.48,135.17 167.48,78.46 194.28,51.66 194.28,40.49 188.11,34.32 168.93,34.32 162.15,27.54 162.15,26.1 162.15,26 JP19.23
TLPORT_A_BITS_MASK[0]
  Bottom 0.2: SOCKET_5.8 138.2,152.5 138.2,150.6 138.8,150 151.89,150 167.03,134.87 167.03,78.27 193.83,51.47 193.83,40.68 187.93,34.78 168.38,34.78 JP19.22
TLPORT_A_BITS_MASK[1]
  Bottom 0.2: JP19.21 159.6,26.01 159.6,27.89 166.96,35.25 187.75,35.25 193.37,40.86 193.37,51.28 166.57,78.09 166.57,134.58 151.6,149.55 138.61,149.55 SOCKET_5.7
TLPORT_A_BITS_MASK[2]
  Bottom 0.2: JP19.20 166.78,35.71 187.58,35.71 192.92,41.05 192.92,51.1 166.12,77.9 166.12,116.98 146.42,136.68 144.48,136.68 SOCKET_4.25
TLPORT_A_BITS_MASK[3]
  Bottom 0.2: JP19.19 157.05,26.02 157.05,27.88 165.34,36.17 187.39,36.17 192.46,41.24 192.46,50.91 165.66,77.71 165.66,115.5 146.57,134.59 SOCKET_4.24
TLPORT_A_BITS_OPCODE[0]
  Bottom 0.2: SOCKET_2.24 134.39,56.38 134.39,56.3 JP18.8
TLPORT_A_BITS_OPCODE[1]
  Bottom 0.2: JP18.7 141.85,45.98 141.85,47.9 133.05,56.7 133.05,59.43 SOCKET_2.23
TLPORT_A_BITS_OPCODE[2]
  Bottom 0.2: SOCKET_2.21 130.55,59.47 130.55,56.95 139.25,48.25 139.25,46.28 JP18.3
TLPORT_A_BITS_PARAM[0]
  Bottom 0.2: JP18.13 149.45,46 149.45,47.85 140.8,56.5 140.8,59.44 SOCKET_2.27
TLPORT_A_BITS_PARAM[1]
  Bottom 0.2: SOCKET_2.26 136.93,55.98 JP18.10
TLPORT_A_BITS_PARAM[2]
  Bottom 0.2: JP18.9 144.4,45.97 144.4,47.85 135.7,56.55 135.7,59.54 SOCKET_2.25
TLPORT_A_BITS_SIZE[0]
  Bottom 0.2: SOCKET_3.9 144.49,75.35 146.45,75.35 147.96,73.84 147.96,52.95 153.26,47.65 JP18.16
TLPORT_A_BITS_SIZE[1]
  Bottom 0.2: JP18.15 152,45.99 152,48.2 147.5,52.7 147.5,72.34 146.59,73.25 SOCKET_3.8
TLPORT_A_BITS_SIZE[2]
  Bottom 0.2: JP18.14 147.05,50.94 147.05,72.15 146.4,72.8 144.5,72.8 SOCKET_3.7
TLPORT_A_BITS_SOURCE[0]
  Bottom 0.2: JP18.22 160.88,48.07 150.68,57.95 150.68,81.22 146.4,85.5 144.5,85.5 SOCKET_3.17
TLPORT_A_BITS_SOURCE[1]
  Bottom 0.2: JP18.21 159.63,45.99 159.63,48.22 150.23,57.62 150.23,79.12 146.4,82.95 144.51,82.95 SOCKET_3.15
TLPORT_A_BITS_SOURCE[2]
  Bottom 0.2: JP18.20 158.34,48.01 149.77,56.26 149.77,77.69 SOCKET_3.14
TLPORT_A_BITS_SOURCE[3]
  Bottom 0.2: JP18.19 157.04,46.02 157.04,48.2 149.32,55.92 149.32,77.48 146.4,80.4 144.52,80.4 SOCKET_3.13
TLPORT_A_BITS_SOURCE[4]
  Bottom 0.2: SOCKET_3.12 148.87,76.05 148.87,54.59 155.8,47.66 JP18.18
TLPORT_A_BITS_SOURCE[5]
  Bottom 0.2: JP18.17 154.55,45.98 154.55,48.17 148.41,54.31 148.41,74.03 145.83,76.61 SOCKET_3.10
TLPORT_A_READY
  Bottom 0.2: JP18.4 138.02,46.87 136.75,45.6 136.75,44.4 136.15,43.8 134.8,43.8 126.77,51.83 SOCKET_2.18
TLPORT_A_VALID
  Bottom 0.2: JP18.1 136.75,46.32 136.75,48.25 129.31,55.69 SOCKET_2.20
TLPORT_D_BITS_CORRUPT
  Bottom 0.2: JP20.40 58.49,43.3 25.85,43.3 24.55,44.6 24.55,48.09 48.88,72.42 48.88,109.33 63.5,123.95 65.51,123.95 SOCKET_7.19
TLPORT_D_BITS_DATA[0]
  Bottom 0.2: SOCKET_8.25 68.05,72.79 68.05,65.85 64.2,62 64.2,57.29 68.55,52.94 69.26,52.94 73.7,48.49 73.7,48.41 JP21.40
TLPORT_D_BITS_DATA[1]
  Bottom 0.2: JP21.39 73.25,46.32 73.25,48.3 69.07,52.48 68.2,52.48 62.95,57.73 62.95,75.33 SOCKET_8.24
TLPORT_D_BITS_DATA[2]
  Bottom 0.2: SOCKET_8.23 65.53,77.85 63.5,77.85 62.5,76.85 62.5,57.32 71.98,47.84 JP21.38
TLPORT_D_BITS_DATA[3]
  Bottom 0.2: SOCKET_8.21 65.52,80.4 63.5,80.4 62.04,78.94 62.04,56.86 70.7,48.2 70.7,46.33 JP21.37
TLPORT_D_BITS_DATA[4]
  Bottom 0.2: SOCKET_8.20 63.39,80.85 63.31,80.85 61.59,79.13 61.59,55.45 68.65,48.39 68.65,48.38 JP21.36
TLPORT_D_BITS_DATA[5]
  Bottom 0.2: SOCKET_8.18 61.13,81.13 61.13,55.27 68.2,48.2 68.2,46.29 JP21.35
TLPORT_D_BITS_DATA[6]
  Bottom 0.2: SOCKET_8.17 65.5,85.5 63.6,85.5 60.68,82.58 60.68,53.76 66.85,47.59 JP21.34
TLPORT_D_BITS_DATA[7]
  Bottom 0.2: SOCKET_8.15 65.49,88.05 63.6,88.05 60.23,84.68 60.23,53.57 65.6,48.2 65.6,46.35 JP21.33
TLPORT_D_BITS_DATA[8]
  Bottom 0.2: SOCKET_8.14 63.42,88.5 63.41,88.5 59.77,84.86 59.77,52.48 64.36,47.89 JP21.32
TLPORT_D_BITS_DATA[9]
  Bottom 0.2: SOCKET_8.13 65.48,90.6 63.6,90.6 59.32,86.32 59.32,51.83 63.1,48.05 63.1,46.31 JP21.31
TLPORT_D_BITS_DATA[10]
  Bottom 0.2: SOCKET_8.12 63.43,91.05 63.41,91.05 58.86,86.51 58.86,51.1 58.86,50.97 58.86,48.01 JP21.28
TLPORT_D_BITS_DATA[11]
  Bottom 0.2: SOCKET_8.11 65.52,93.1 63.55,93.1 58.41,87.96 58.41,51.2 58.41,51.16 58.41,48.62 58.15,48.36 58.15,48.35 58,48.2 58,46.33 JP21.27
TLPORT_D_BITS_DATA[12]
  Bottom 0.2: SOCKET_8.10 63.39,93.55 63.36,93.55 57.96,88.15 57.96,51.4 57.96,51.35 57.96,48.81 JP21.26
TLPORT_D_BITS_DATA[13]
  Bottom 0.2: SOCKET_8.9 65.51,95.65 63.55,95.65 57.5,89.6 57.5,50.25 55.45,48.2 55.45,46.34 JP21.25
TLPORT_D_BITS_DATA[14]
  Bottom 0.2: SOCKET_8.7 65.5,98.2 63.6,98.2 57.05,91.65 57.05,54.23 54.2,51.39 JP21.24
TLPORT_D_BITS_DATA[15]
  Bottom 0.2: SOCKET_8.6 63.41,98.65 56.59,91.84 56.59,54.42 52.95,50.78 52.95,46.3 JP21.23
TLPORT_D_BITS_DATA[16]
  Bottom 0.2: SOCKET_8.5 65.54,100.7 63.55,100.7 56.14,93.29 56.14,56.7 56.14,55.84 51.66,51.36 JP21.22
TLPORT_D_BITS_DATA[17]
  Bottom 0.2: SOCKET_8.4 63.37,101.15 63.36,101.15 55.69,93.48 55.69,56.03 50.35,50.69 50.35,46.36 JP21.21
TLPORT_D_BITS_DATA[18]
  Bottom 0.2: SOCKET_8.3 65.48,103.3 63.55,103.3 55.23,94.98 55.23,57.75 55.23,57.5 55.23,56.22 49.12,50.1 JP21.20
TLPORT_D_BITS_DATA[19]
  Bottom 0.2: SOCKET_8.2 63.43,103.75 63.36,103.75 54.78,95.17 54.78,58.2 54.78,57.69 54.78,56.4 47.9,49.52 47.9,46.27 JP21.19
TLPORT_D_BITS_DATA[20]
  Bottom 0.2: SOCKET_8.1 65.52,105.8 63.55,105.8 54.32,96.57 54.32,59.35 54.32,57.88 54.32,56.59 46.58,48.85 JP21.18
TLPORT_D_BITS_DATA[21]
  Bottom 0.2: SOCKET_7.32 53.87,97.09 53.87,61.15 53.87,59.32 53.87,56.78 45.3,48.21 45.3,46.33 JP21.17
TLPORT_D_BITS_DATA[22]
  Bottom 0.2: SOCKET_7.31 65.52,108.7 63.55,108.7 53.42,98.57 53.42,60.4 53.42,59.51 53.42,56.97 JP21.16
TLPORT_D_BITS_DATA[23]
  Bottom 0.2: SOCKET_7.29 65.51,111.25 63.65,111.25 52.96,100.56 52.96,61.55 52.96,60.96 52.96,58.41 42.78,48.22 42.78,46.31 JP21.15
TLPORT_D_BITS_DATA[24]
  Bottom 0.2: SOCKET_7.28 52.51,100.81 52.51,65.3 52.51,64.94 52.51,58.6 JP21.14
TLPORT_D_BITS_DATA[25]
  Bottom 0.2: SOCKET_7.27 65.5,113.8 63.6,113.8 52.05,102.25 52.05,66.7 52.05,65.12 52.05,60.05 40.25,48.25 40.25,46.3 JP21.13
TLPORT_D_BITS_DATA[26]
  Bottom 0.2: SOCKET_7.26 63.41,114.25 52.05,102.9 51.6,102.44 51.6,62.77 JP21.10
TLPORT_D_BITS_DATA[27]
  Bottom 0.2: SOCKET_7.25 65.49,116.35 63.55,116.35 51.15,103.95 51.15,64.22 35.1,48.17 35.1,46.37 JP21.9
TLPORT_D_BITS_DATA[28]
  Bottom 0.2: SOCKET_7.23 65.48,118.9 63.55,118.9 50.69,106.04 50.69,70.4 50.69,69.85 50.69,64.4 JP21.8
TLPORT_D_BITS_DATA[29]
  Bottom 0.2: SOCKET_7.22 63.43,119.35 63.36,119.35 50.24,106.23 50.24,70.8 50.24,70.59 50.24,65.85 32.65,48.26 32.65,46.28 JP21.7
TLPORT_D_BITS_DATA[30]
  Bottom 0.2: SOCKET_7.21 65.47,121.45 63.6,121.45 49.78,107.63 49.78,70.35 49.78,68.58 49.78,66.03 JP21.6
TLPORT_D_BITS_DATA[31]
  Bottom 0.2: SOCKET_7.20 63.44,121.9 63.41,121.9 49.33,107.82 49.33,71.3 49.33,70.66 49.33,67.53 30.1,48.3 30.1,46.29 JP21.5
TLPORT_D_BITS_DENIED
  Bottom 0.2: JP20.39 73.25,26 73.25,27.75 58.15,42.85 25.66,42.85 24.09,44.42 24.09,48.28 48.42,72.61 48.42,109.51 63.31,124.4 63.4,124.4 SOCKET_7.18
TLPORT_D_BITS_OPCODE[0]
  Bottom 0.2: JP20.24 44.52,36.94 23.22,36.94 18.19,41.97 18.19,50.72 42.49,75.02 42.49,134.02 64.37,155.91 77.94,155.91 79.4,154.45 79.4,152.48 SOCKET_6.21
TLPORT_D_BITS_OPCODE[1]
  Bottom 0.2: JP20.23 52.9,26.03 52.9,27.93 44.34,36.49 23.03,36.49 17.74,41.78 17.74,50.91 42.03,75.21 42.03,134.21 64.19,156.36 78.13,156.36 79.85,154.64 79.85,154.61 SOCKET_6.20
TLPORT_D_BITS_OPCODE[2]
  Bottom 0.2: JP20.22 42.89,36.04 22.84,36.04 17.28,41.59 17.28,51.1 41.58,75.39 41.58,134.4 64,156.82 80.18,156.82 SOCKET_6.18
TLPORT_D_BITS_PARAM[0]
  Bottom 0.2: JP20.26 46.16,37.85 23.59,37.85 19.1,42.35 19.1,50.34 43.4,74.64 43.4,133.65 64.75,155 74.38,155 SOCKET_6.24
TLPORT_D_BITS_PARAM[1]
  Bottom 0.2: JP20.25 55.5,25.97 55.5,27.87 45.97,37.4 23.41,37.4 18.64,42.16 18.64,50.53 42.94,74.83 42.94,133.83 64.56,155.45 75.8,155.45 76.85,154.4 76.85,152.47 SOCKET_6.23
TLPORT_D_BITS_SINK
  Bottom 0.2: JP20.38 56.86,42.39 25.47,42.39 23.64,44.23 23.64,48.46 47.97,72.79 47.97,110.92 63.5,126.45 65.55,126.45 SOCKET_7.17
TLPORT_D_BITS_SIZE[0]
  Bottom 0.2: JP20.31 63.1,25.99 63.1,27.89 51.77,39.21 24.16,39.21 20.46,42.91 20.46,49.78 44.78,74.11 44.78,118.58 63.26,137.05 63.35,137.05 SOCKET_7.8
TLPORT_D_BITS_SIZE[1]
  Bottom 0.2: JP20.28 47.79,38.76 23.97,38.76 20.01,42.72 20.01,49.97 44.33,74.29 44.33,120.03 63.4,139.1 65.6,139.1 SOCKET_7.7
TLPORT_D_BITS_SIZE[2]
  Bottom 0.2: JP20.27 58,26.01 58,27.9 47.59,38.31 23.78,38.31 19.55,42.53 19.55,50.16 43.85,74.45 43.85,127.15 63.7,147 68.84,147 SOCKET_6.25
TLPORT_D_BITS_SOURCE[0]
  Bottom 0.2: JP20.37 70.7,26.01 70.7,27.91 56.67,41.94 25.29,41.94 23.18,44.04 23.18,48.65 47.51,72.98 47.51,113.01 63.5,129 65.54,129 SOCKET_7.15
TLPORT_D_BITS_SOURCE[1]
  Bottom 0.2: JP20.36 55.23,41.48 25.1,41.48 22.73,43.85 22.73,48.84 47.06,73.17 47.06,113.2 63.31,129.45 63.37,129.45 SOCKET_7.14
TLPORT_D_BITS_SOURCE[2]
  Bottom 0.2: JP20.35 68.15,26.02 68.15,27.92 55.04,41.03 24.91,41.03 22.28,43.66 22.28,49.03 46.6,73.35 46.6,114.6 63.55,131.55 65.53,131.55 SOCKET_7.13
TLPORT_D_BITS_SOURCE[3]
  Bottom 0.2: JP20.34 53.59,40.58 24.72,40.58 21.82,43.48 21.82,49.22 46.15,73.54 46.15,114.79 63.36,132 63.38,132 SOCKET_7.12
TLPORT_D_BITS_SOURCE[4]
  Bottom 0.2: JP20.33 65.6,26.03 65.6,27.7 53.18,40.12 24.53,40.12 21.37,43.29 21.37,49.4 45.69,73.73 45.69,116.85 SOCKET_7.10
TLPORT_D_BITS_SOURCE[5]
  Bottom 0.2: JP20.32 51.96,39.67 24.35,39.67 20.91,43.1 20.91,49.59 45.24,73.92 45.24,118.39 63.45,136.6 65.56,136.6 SOCKET_7.9
TLPORT_D_READY
  Bottom 0.2: JP20.20 41.26,35.13 22.47,35.13 16.37,41.22 16.37,51.47 40.67,75.77 40.67,134.77 63.62,157.72 83.73,157.72 87.05,154.4 87.05,152.51 SOCKET_6.15
TLPORT_D_VALID
  Bottom 0.2: JP20.21 50.35,26.04 50.35,27.94 42.7,35.58 22.65,35.58 16.83,41.41 16.83,51.28 41.13,75.58 41.13,134.59 63.81,157.27 81.63,157.27 84.45,154.45 84.45,152.45 SOCKET_6.17
TMS  (via drill 0.4)
  Top 0.2: R22.1 v18.5,12.5 19.6,13.6 20.94,13.6 26.37,8.17 IC4.13
  Bottom 0.2: v18.5,12.5 18.5,6.96 JTAG_20_PIN.7
UART_RXD  (via drill 0.4)
  Top 0.2: SOCKET_2.4 108.99,57.05 115.8,50.24 v115.8,48.3
  Bottom 0.2: v115.8,48.3 115.8,12.68 116.16,12.32 116.16,7.82 USB-UART.3
UART_TXD  (via drill 0.4)
  Top 0.2: SOCKET_2.3 107.72,59.5 107.72,56 114.4,49.32 v114.4,44.4
  Bottom 0.2: v114.4,44.4 114.4,12.68 USB-UART.7
VDD_1.8_1
  Top 0.2: C14.1 IC7.2 IC7.4 191.72,136.47 188.01,136.47 JP8.1 | C14.1 195.5,149.55 | 195.5,149.55 Q3.1 | R63.2 195.7,149.35 195.5,149.55 | C14.1 192.5,148.45 192.5,154.15 R1.2
  pour Top: 184.95,133.55 188,136.6 191.65,136.6 193.35,138.3 193.35,141.3 193.3,141.35 193.3,145.2 193.35,145.25 193.55,145.25 193.55,138.15 191.7,136.3 188.1,136.3 185.2,133.4 185.05,133.4 184.95,133.5
VDD_1.8_2
  Top 0.2: C16.1 IC8.2 IC8.4 181.45,134.99 JP8.5 | C16.1 183.5,149.55 Q4.1 | C16.1 183.3,149.35 R61.2 | C16.1 180,148.95 180,154.15 R3.2
  pour Top: 181.15,145.25 181.35,145.05 181.35,135.1 179.85,133.6 179.85,133.5 180.1,133.5 181.55,134.95 181.55,145.05 181.65,145.15 181.3,145.15 181.2,145.25
VDD_1.8_3
  Top 0.2: C18.1 IC9.2 IC9.4 172.66,138.2 JP8.7 | C18.1 171.5,149.55 | 171.5,149.55 Q5.1 | R62.2 171.7,149.35 171.5,149.55 | C18.1 168,148.95 168,154.15 R5.2
  pour Top: 169.4,145.25 169.4,138.15 172.4,138.15 177.3,133.25 177.75,133.25 172.75,138.25 170.25,138.25 169.55,138.95 169.55,145.25